# EasyEDA Pro project Project.eprj

# Schematic Main
Create Date: 2022-11-24; Page Name: P1; Project Name: OpenWDMX-Ext; Schematic Name: Main; Update Date: 2022-11-25; Company: EasyEDA.com; Drawed: EasyEDA Pro; Page Size: A4; Part Number: JLCPCB-002; Reviewed: EasyEDA Pro; Version: V0.1
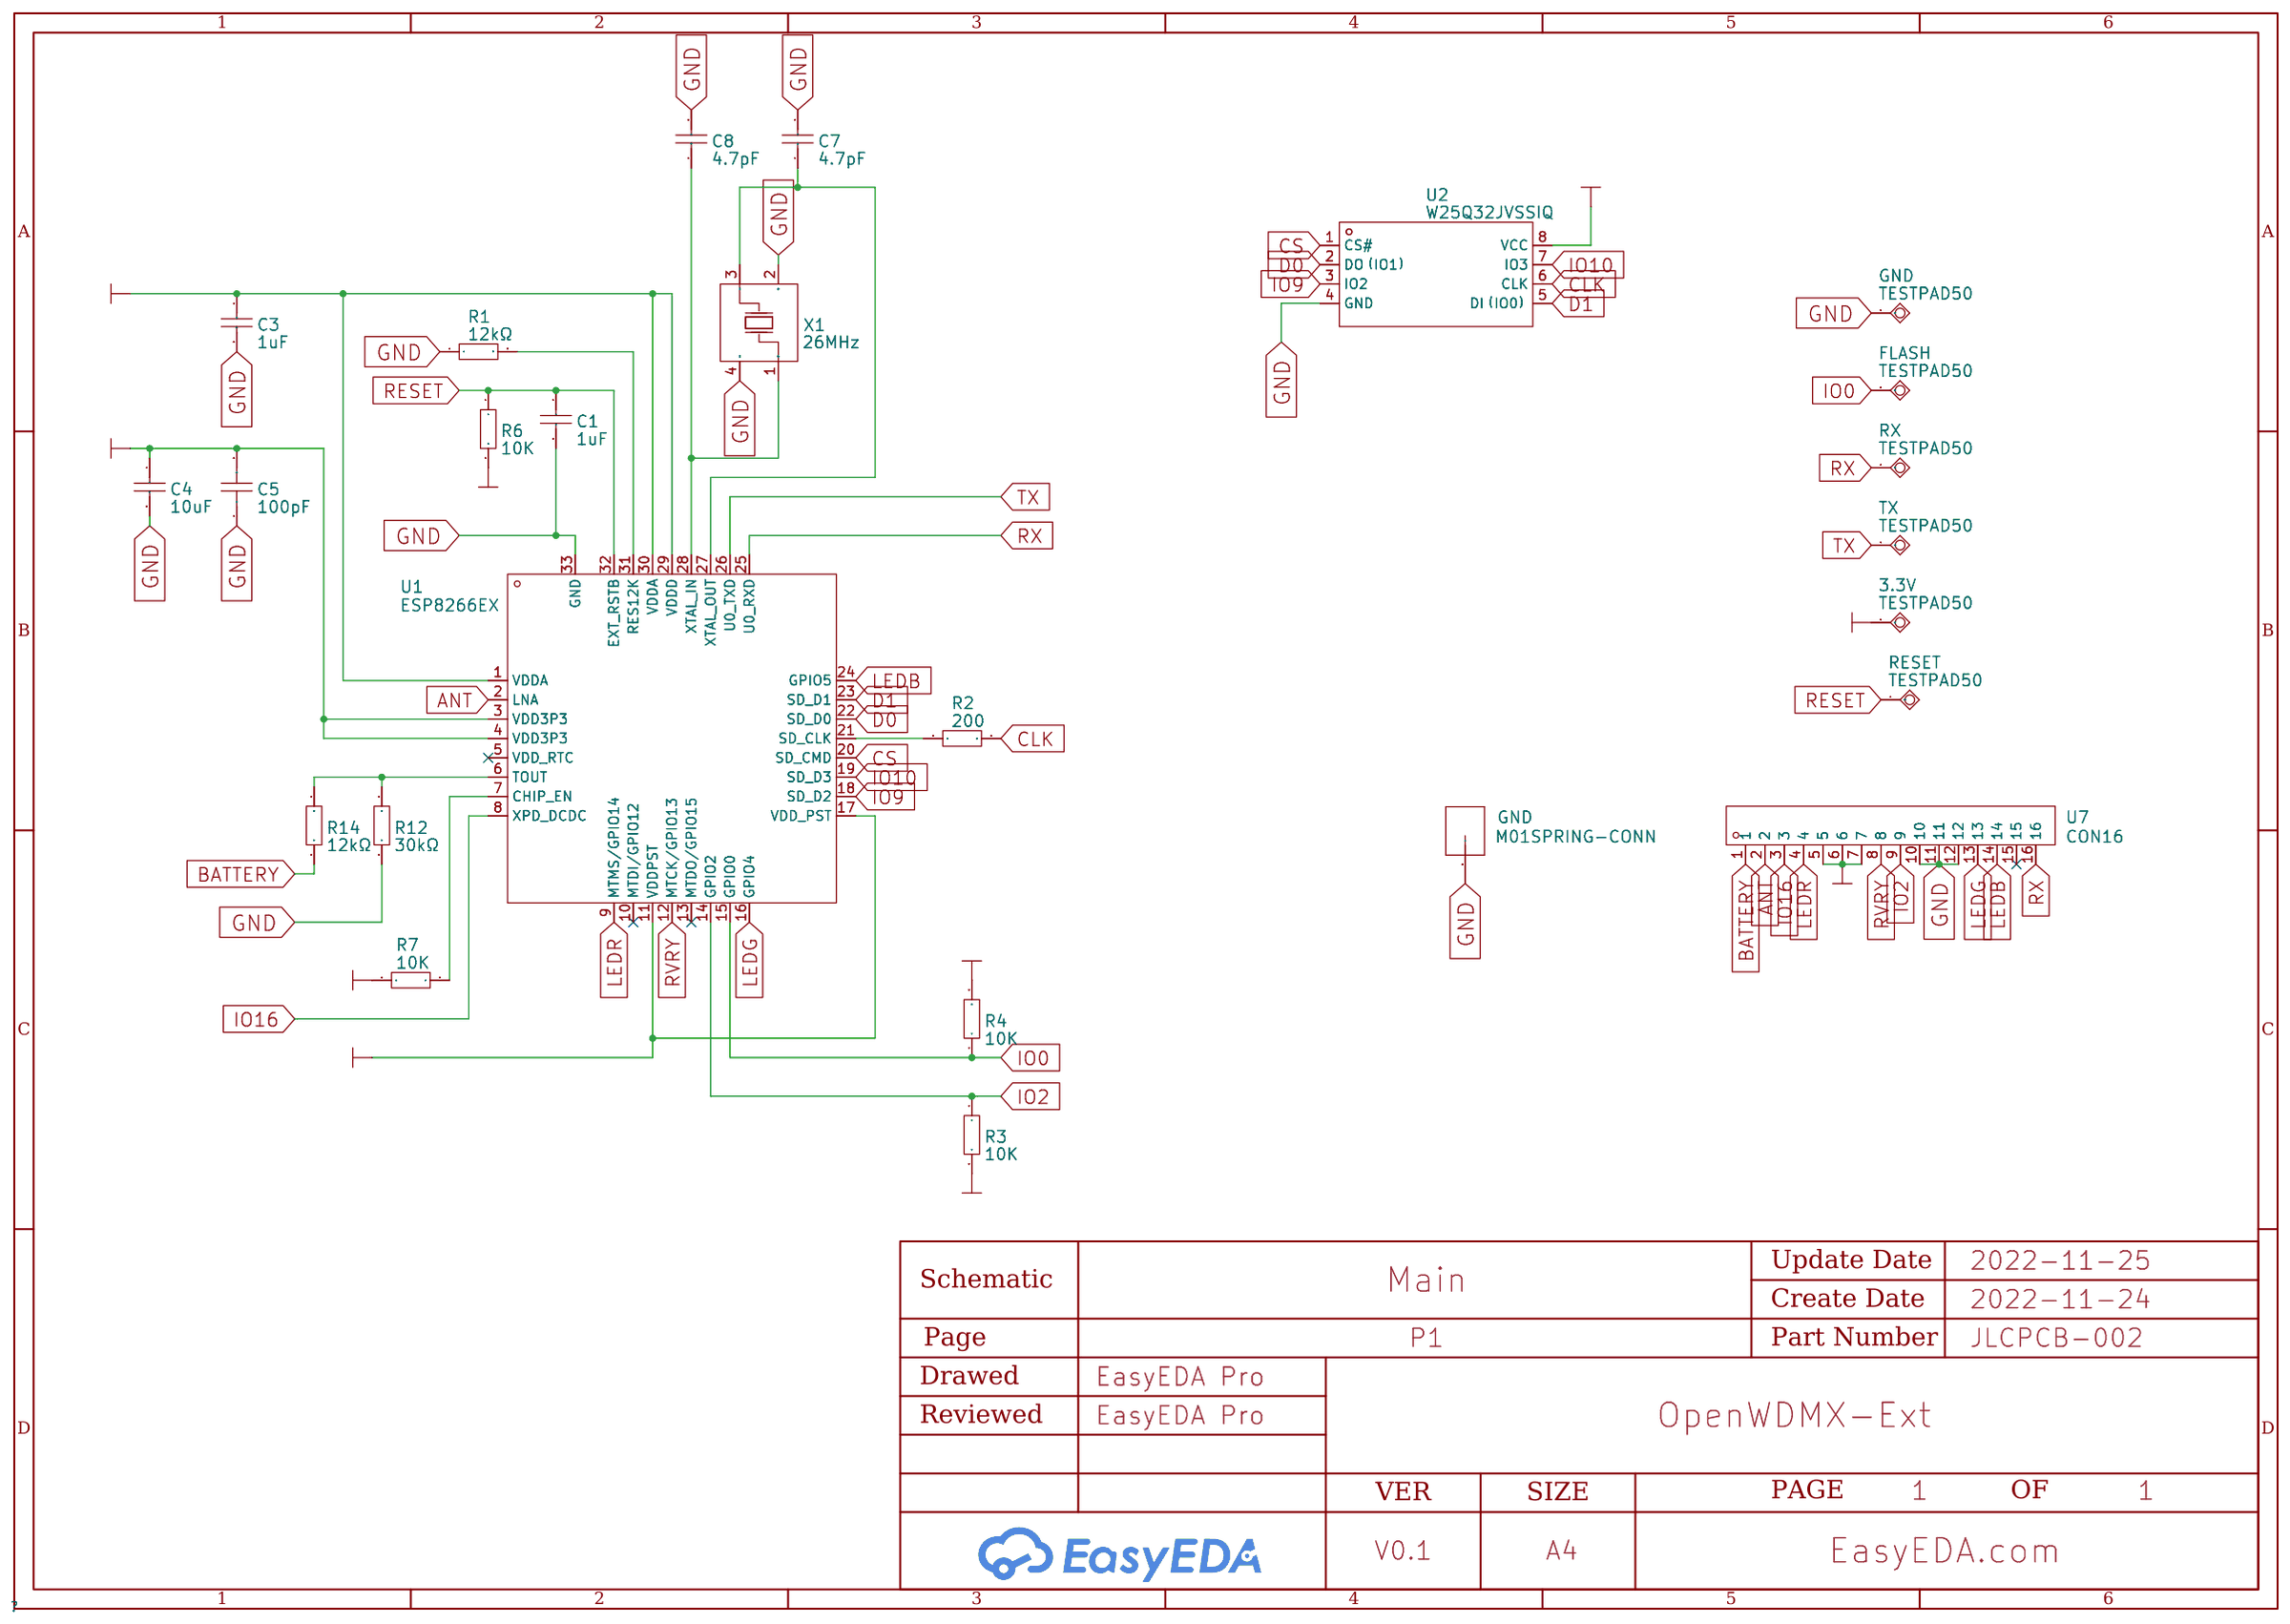
[diagram p0: schematic sheet]

## Parts
3.3V  TESTPAD50  [TESTPAD-50-ROUND]
C1  1uF  [C0402]
C3  1uF  [C0402]
C4  10uF  [C0402]
C5  100pF  [C0603]
C7  4.7pF  [C0402]
C8  4.7pF  [C0402]
FLASH  TESTPAD50  [TESTPAD-50-ROUND]
GND  M01SPRING-CONN  [SPRING-CONNECTOR]
GND#2  TESTPAD50  [TESTPAD-50-ROUND]
R1  12kΩ  [R0402]
R2  200  [R0402]
R3  10K  [R0402]
R4  10K  [R0402]
R6  10K  [R0402]
R7  10K  [R0402]
R12  30kΩ  [R0402]
R14  12kΩ  [R0402]
RESET  TESTPAD50  [TESTPAD-50-ROUND]
RX  TESTPAD50  [TESTPAD-50-ROUND]
TX  TESTPAD50  [TESTPAD-50-ROUND]
U1  ESP8266EX  [QFN-32_L5.0-W5.0-P0.50-BL-EP3.7]
U2  W25Q32JVSSIQ  [SOIC-8_L5.3-W5.3-P1.27-LS8.0-BL]
U7  CON16  [CON16]
X1  26MHz  [CRYSTAL-SMD_4P-L3.2-W2.5-BL]

## Library data of the parts
3.3V FLASH GND#2 RESET RX TX = TESTPAD50
C1 C3 = 1uF: link: https://item.szlcsc.com/15869.html; 3DModel: C0402_L1.0-W0.5-H0.5; Supplier: LCSC; Manufacturer Part: CL05A105KP5NNNC; Manufacturer: SAMSUNG; Supplier Part: C14445; JLCPCB Part Class: Extended Part
C4 = 10uF: link: https://item.szlcsc.com/15869.html; 3DModel: C0402_L1.0-W0.5-H0.5; Supplier: LCSC; Manufacturer Part: CL05A106MQ5NUNC; Manufacturer: SAMSUNG; Supplier Part: C15525; JLCPCB Part Class: Basic Part
C5 = 100pF: link: https://item.szlcsc.com/362304.html; 3DModel: C0603_L1.6-W0.8-H0.8; Supplier: LCSC; Manufacturer: YAGEO(国巨); Manufacturer Part: CC0603JRNPO9BN101; Supplier Part: C14665; JLCPCB Part Class: Extended Part
C7 C8 = 4.7pF: link: https://item.szlcsc.com/15869.html; 3DModel: C0402_L1.0-W0.5-H0.5; Supplier: LCSC; Manufacturer: FH; Manufacturer Part: 0402CG4R7C500NT; Supplier Part: C1569; JLCPCB Part Class: Basic Part
GND = M01SPRING-CONN
R1 R14 = 12kΩ: link: https://item.szlcsc.com/323315.html; 3DModel: R0402_L1.0-W0.5-H0.5; Supplier: LCSC; Manufacturer: RALEC; Manufacturer Part: RTT021202FTH; Supplier Part: C102781; Resistance: 12K; JLCPCB Part Class: Extended Part
R2 = 200: link: https://item.szlcsc.com/323315.html; 3DModel: R0402_L1.0-W0.5-H0.5; Supplier: LCSC; Manufacturer: YAGEO(国巨); Manufacturer Part: RC0402FR-07200RL; Supplier Part: C114764; JLCPCB Part Class: Extended Part; Resistance: 200Ω
R3 R4 R6 R7 = 10K: link: https://item.szlcsc.com/323315.html; 3DModel: R0402_L1.0-W0.5-H0.5; Supplier: LCSC; Manufacturer: YAGEO; Manufacturer Part: RC0402FR-0710KL; Supplier Part: C60490; JLCPCB Part Class: Extended Part; Resistance: 10kΩ
R12 = 30kΩ: link: https://item.szlcsc.com/323315.html; 3DModel: R0402_L1.0-W0.5-H0.5; Supplier: LCSC; Supplier Part: C317882; Manufacturer: Guangdong Fenghua Advanced Tech; Manufacturer Part: RC-02W3002FT; Resistance: 30K; JLCPCB Part Class: Extended Part
U1 = ESP8266EX: link: https://item.szlcsc.com/18002.html; 3DModel: QFN-32_L5.0-W5.0-H0.8-P0.50-BL-EP3.7; Supplier: LCSC; Manufacturer: ESPRESSIF; Supplier Part: C77967; JLCPCB Part Class: Extended Part; Frequency: 2.4GHz
U2 = W25Q32JVSSIQ: link: https://item.szlcsc.com/63461.html; 3DModel: SOIC-8_L5.3-W5.3-H1.9-LS7.9-P1.27; Supplier: LCSC; Manufacturer: WINBOND; Supplier Part: C82344; JLCPCB Part Class: Extended Part
U7 = CON16
X1 = 26MHz: link: https://item.szlcsc.com/15866.html; 3DModel: OSC-SMD_4P-L3.2-W2.5-H1.0; Supplier: LCSC; Manufacturer: YXC; Manufacturer Part: X322526MMB4SI; Supplier Part: C15192; JLCPCB Part Class: Extended Part

## Nets
+3.3V: 3.3V.1(PP) C3.1 C4.1 C5.2 R3.2 R4.2 R6.2 R7.2 U1.1(VDDA) U1.3(VDD3P3) U1.4(VDD3P3) U1.11(VDDPST) U1.17(VDD_PST) U1.29(VDDD) U1.30(VDDA) U2.8(VCC) U7.5 U7.6 U7.7
GND: C1.2 C3.2 C4.2 C5.1 C7.2 C8.2 GND.P$2(1) GND#2.1(PP) R1.1 R12.2 U1.33(GND) U2.4(GND) U7.10 U7.11 U7.12 X1.2(GND) X1.4(GND)
ANT: U1.2(LNA) U7.2
BATTERY: R14.2 U7.1
CLK: R2.2 U2.6(CLK)
CS: U1.20(SD_CMD) U2.1(CS#)
D0: U1.22(SD_D0) U2.2(DO（IO1）)
D1: U1.23(SD_D1) U2.5(DI（IO0）)
IO0: FLASH.1(PP) R4.1 U1.15(GPIO0)
IO2: R3.1 U1.14(GPIO2) U7.9
IO9: U1.18(SD_D2) U2.3(IO2)
IO10: U1.19(SD_D3) U2.7(IO3)
IO16: U1.8(XPD_DCDC) U7.3
LEDB: U1.24(GPIO5) U7.14
LEDG: U1.16(GPIO4) U7.13
LEDR: U1.9(MTMS/GPIO14) U7.4
RESET: C1.1 R6.1 RESET.1(PP) U1.32(EXT_RSTB)
RVRY: U1.12(MTCK/GPIO13) U7.8
RX: RX.1(PP) U1.25(U0_RXD) U7.16
TX: TX.1(PP) U1.26(U0_TXD)
$1N18697: R1.2 U1.31(RES12K)
$1N18698: R7.1 U1.7(CHIP_EN)
$1N18707: C8.1 U1.28(XTAL_IN) X1.1(OSC1)
$1N18708: C7.1 U1.27(XTAL_OUT) X1.3(OSC2)
$1N18714: R2.1 U1.21(SD_CLK)
$1N18731: R12.1 R14.1 U1.6(TOUT)

Not connected (* = marked no-connect by the designer): U1 5(VDD_RTC)* 10(MTDI/GPIO12)* 13(MTDO/GPIO15)*; U7 15*

# Schematic Output
Create Date: 2022-11-25; Page Name: P1; Project Name: OpenWDMX-Ext; Schematic Name: Output; Update Date: 2022-11-25; Company: EasyEDA.com; Drawed: EasyEDA Pro; Page Size: A4; Part Number: JLCPCB-002; Reviewed: EasyEDA Pro; Version: V0.1
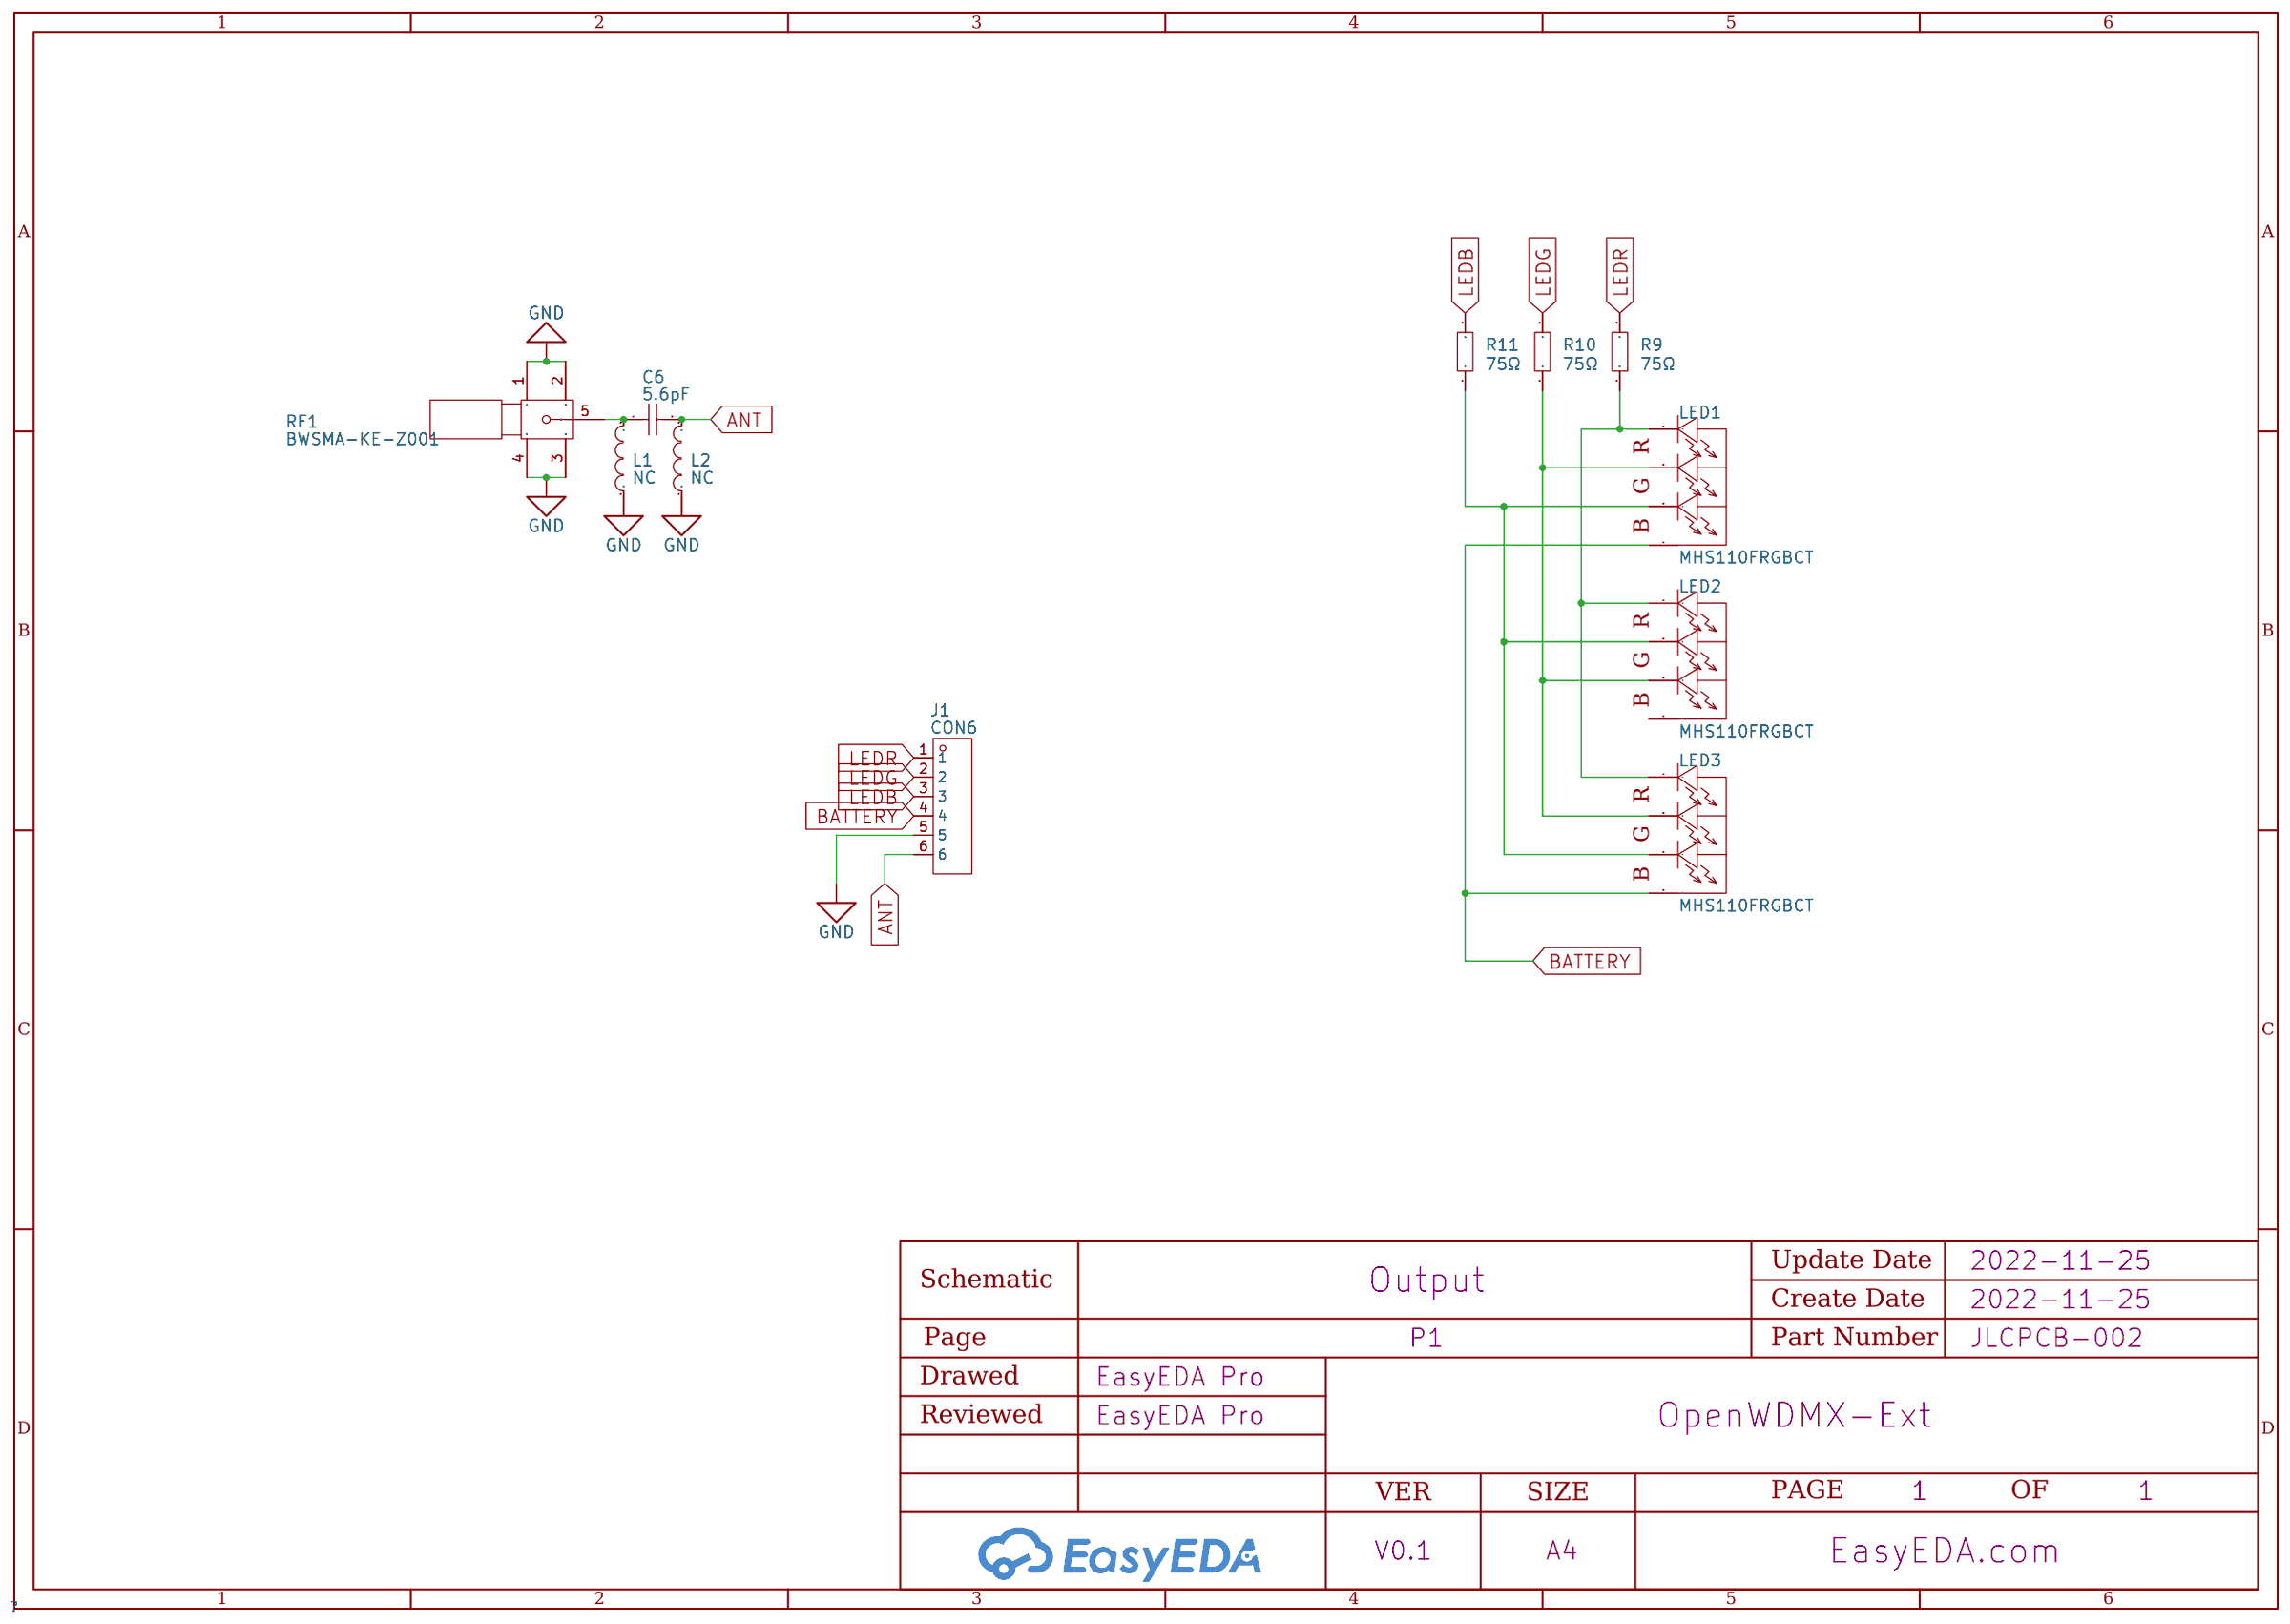
[diagram p1: schematic sheet]

## Parts
C6  5.6pF  [C0603]
J1  CON6  [CON6]
L1  NC  [L0402]
L2  NC  [L0402]
LED1  MHS110FRGBCT  [LED-ARRAY-SMD_MHS110FRGBCT]
LED2  MHS110FRGBCT  [LED-ARRAY-SMD_MHS110FRGBCT]
LED3  MHS110FRGBCT  [LED-ARRAY-SMD_MHS110FRGBCT]
R9  75Ω  [R0603]
R10  75Ω  [R0603]
R11  75Ω  [R0603]
RF1  BWSMA-KE-Z001  [SMA-TH_BWSMA-KE-Z001]

## Library data of the parts
C6 = 5.6pF: link: https://item.szlcsc.com/362304.html; 3DModel: C0603_L1.6-W0.8-H0.8; Supplier: LCSC; Manufacturer: FH(风华); Manufacturer Part: 0603CG5R6C500NT; Supplier Part: C1674; JLCPCB Part Class: Extended Part
J1 = CON6
L1 L2 = NC: link: https://item.szlcsc.com/344049.html; 3DModel: L0402_L1.0-W0.5-H0.5_BEAD; Supplier: LCSC; Manufacturer: Sunlord; Manufacturer Part: SDCL1005C1N5STDF; Supplier Part: C27146; JLCPCB Part Class: Extended Part
LED1-LED3 = MHS110FRGBCT: link: https://item.szlcsc.com/508375.html; Supplier: LCSC; Supplier Part: C496820; Manufacturer: MEIHUA(美华); JLCPCB Part Class: Extended Part
R9-R11 = 75Ω: 3DModel: R0603_L1.6-W0.8-H0.8; link: https://www.mouser.in/datasheet/2/447/PYu_RT_1_to_0_01_RoHS_L_11-1669912.pdf; Supplier: LCSC; Manufacturer: UNI-ROYAL(厚声); Manufacturer Part: 0603WAF750JT5E; Supplier Part: C4275; Resistance: 75; JLCPCB Part Class: Basic Part
RF1 = BWSMA-KE-Z001: link: https://item.szlcsc.com/508498.html; 3DModel: SMA-TH_5P-L6.5-W6.5-H9.8_BWSMA-KE-Z001; Supplier: LCSC; Supplier Part: C496549; Manufacturer: BAT WIRELESS; JLCPCB Part Class: Extended Part

## Nets
GND: J1.5 L1.1 L2.1 RF1.1 RF1.2 RF1.3 RF1.4
ANT: C6.2 J1.6 L2.2
BATTERY: J1.4 LED1.1(+) LED3.1(+)
LEDB: J1.3 R11.2
LEDG: J1.2 R10.1
LEDR: J1.1 R9.2
$1N395: C6.1 L1.2 RF1.5
$1N1788: LED1.4(-) LED2.4(-) LED3.4(-) R9.1
Net-(LED1-2): LED1.2(-) LED2.3(-) LED3.2(-) R11.1
Net-(LED1-3): LED1.3(-) LED2.2(-) LED3.3(-) R10.2

Not connected (* = marked no-connect by the designer): LED2 1(+)

# Schematic Selector
Create Date: 2022-11-25; Page Name: P1; Project Name: OpenWDMX-Ext; Schematic Name: Selector; Update Date: 2022-11-25; Company: EasyEDA.com; Drawed: EasyEDA Pro; Page Size: A4; Part Number: JLCPCB-002; Reviewed: EasyEDA Pro; Version: V0.1
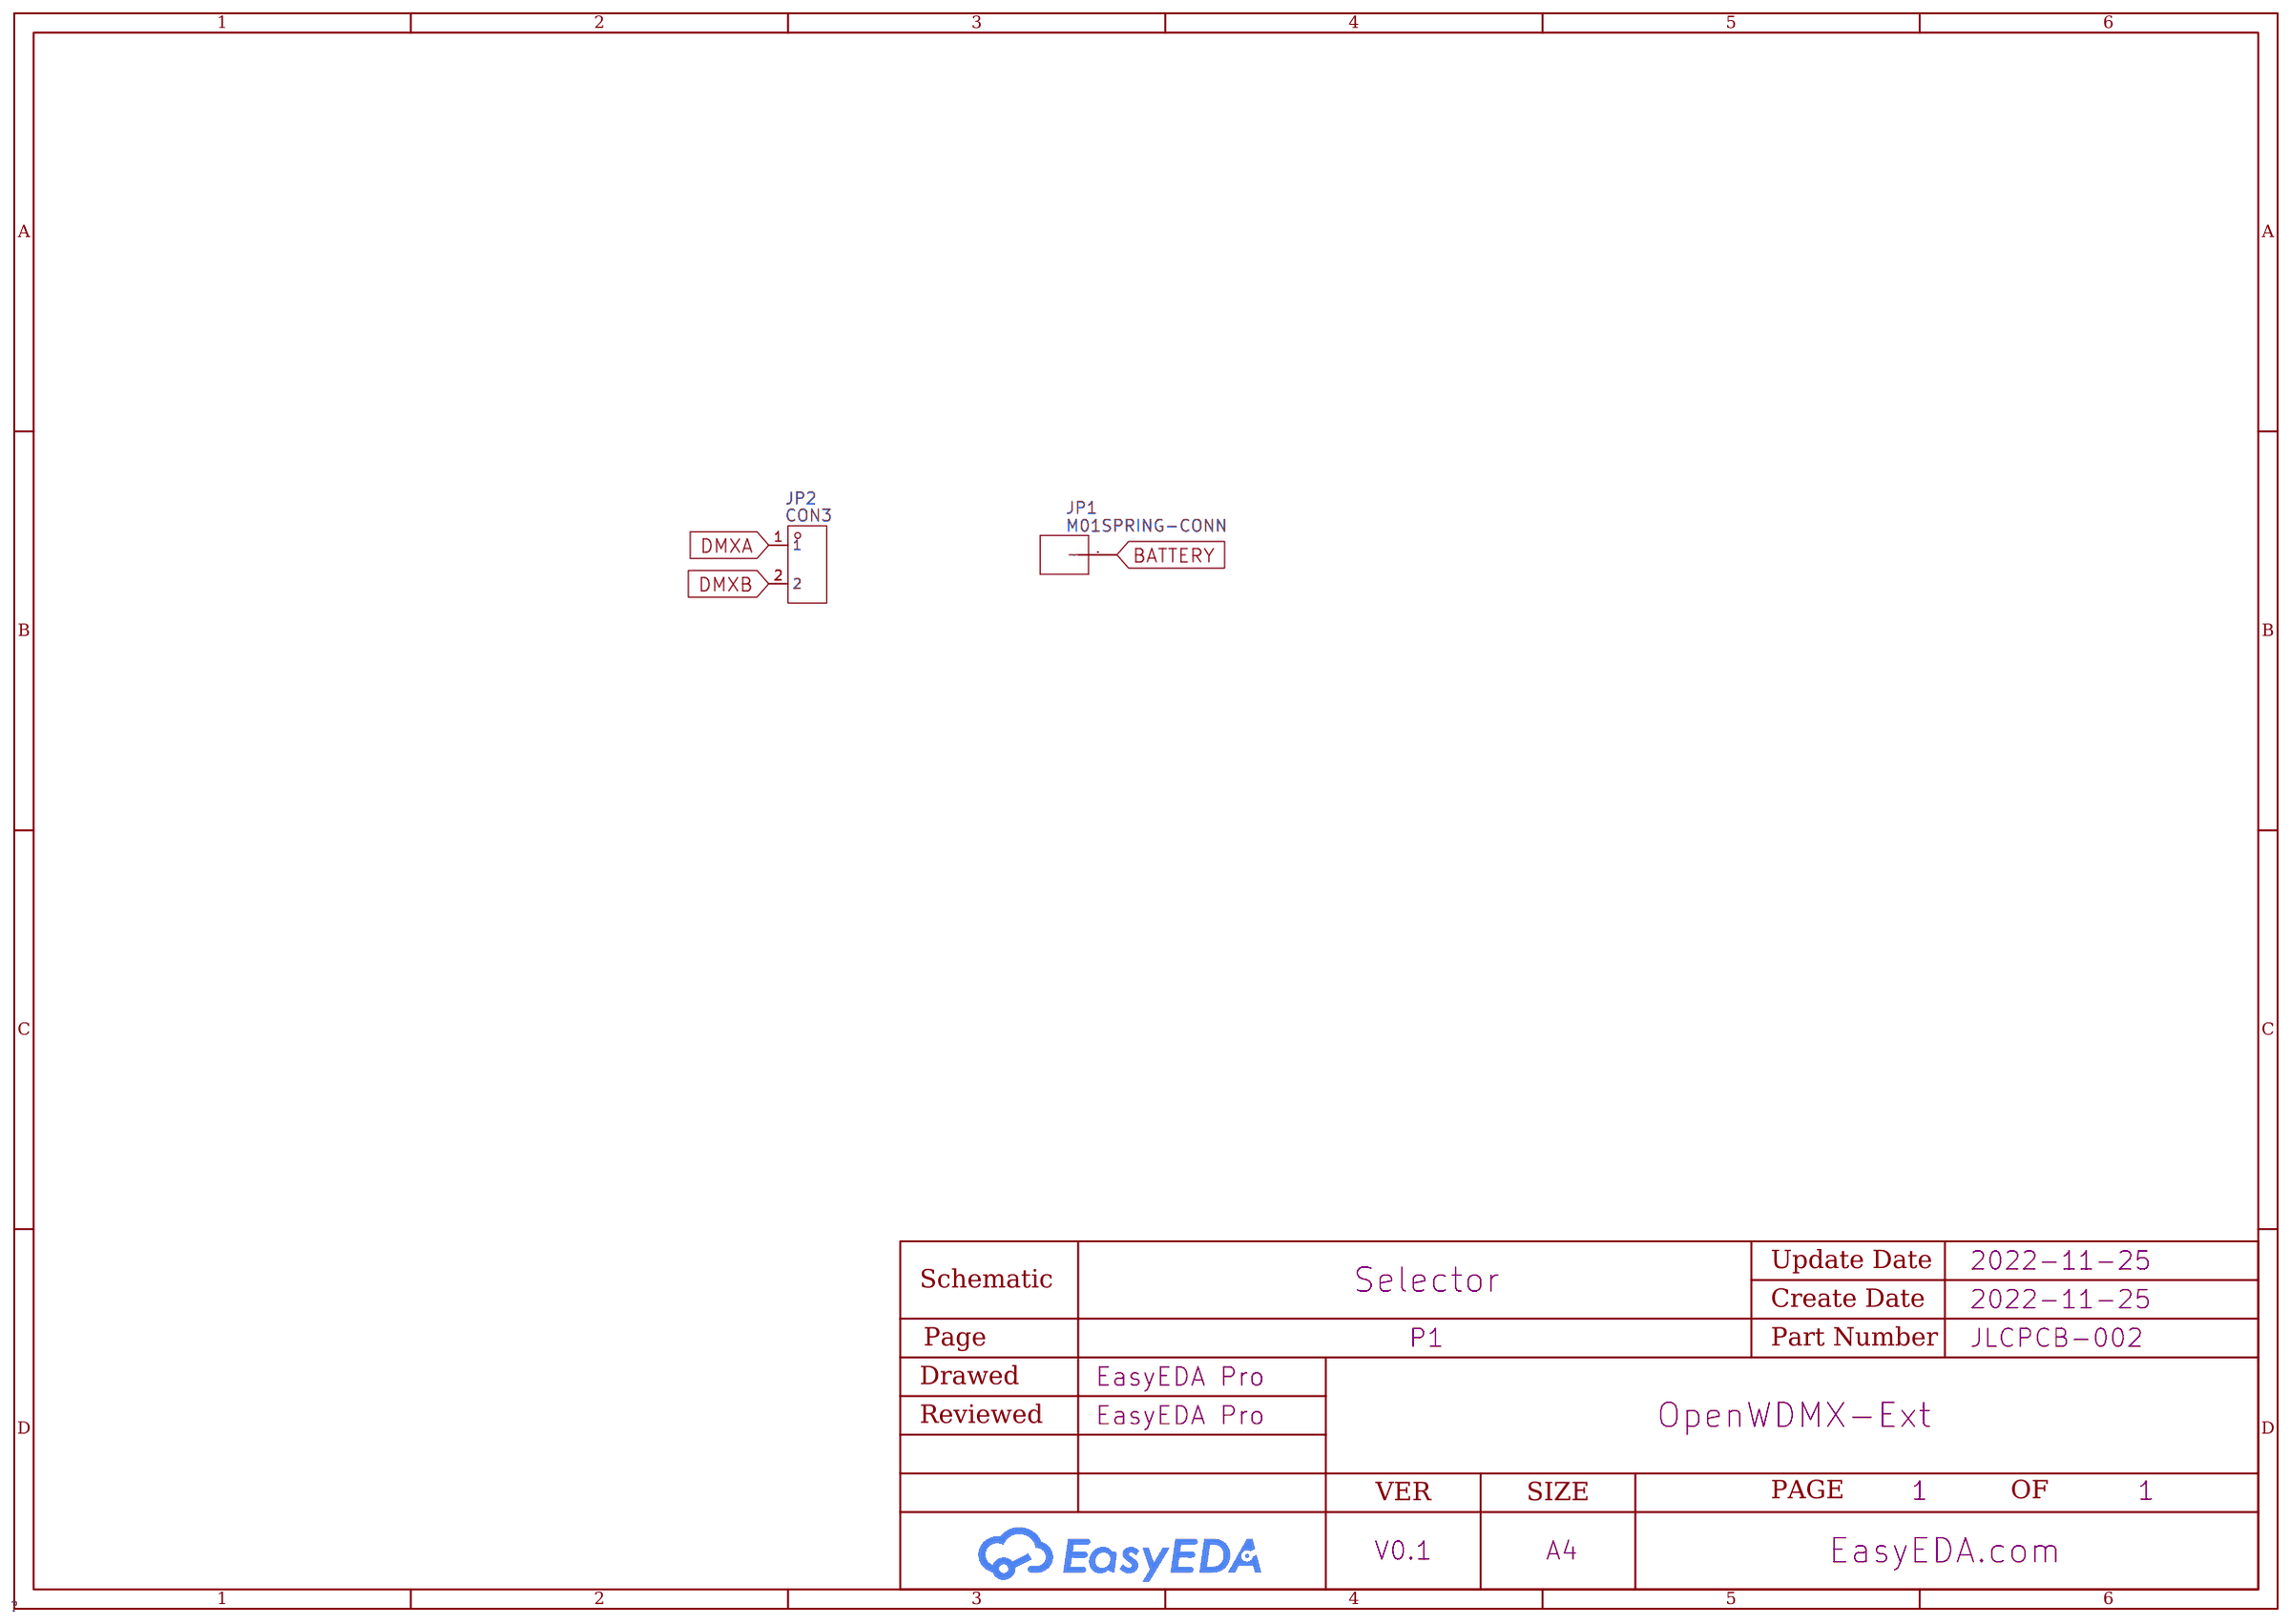
[diagram p2: schematic sheet]

## Parts
JP1  M01SPRING-CONN  [SPRING-CONNECTOR]
JP2  CON3  [CON3]

## Library data of the parts
JP1 = M01SPRING-CONN
JP2 = cON3

## Nets
BATTERY: JP1.P$2(1)
DMXA: JP2.1
DMXB: JP2.2

# Schematic Power
Create Date: 2022-11-25; Page Name: P1; Project Name: OpenWDMX-Ext; Schematic Name: Power; Update Date: 2022-11-25; Company: EasyEDA.com; Drawed: EasyEDA Pro; Page Size: A4; Part Number: JLCPCB-002; Reviewed: EasyEDA Pro; Version: V0.1
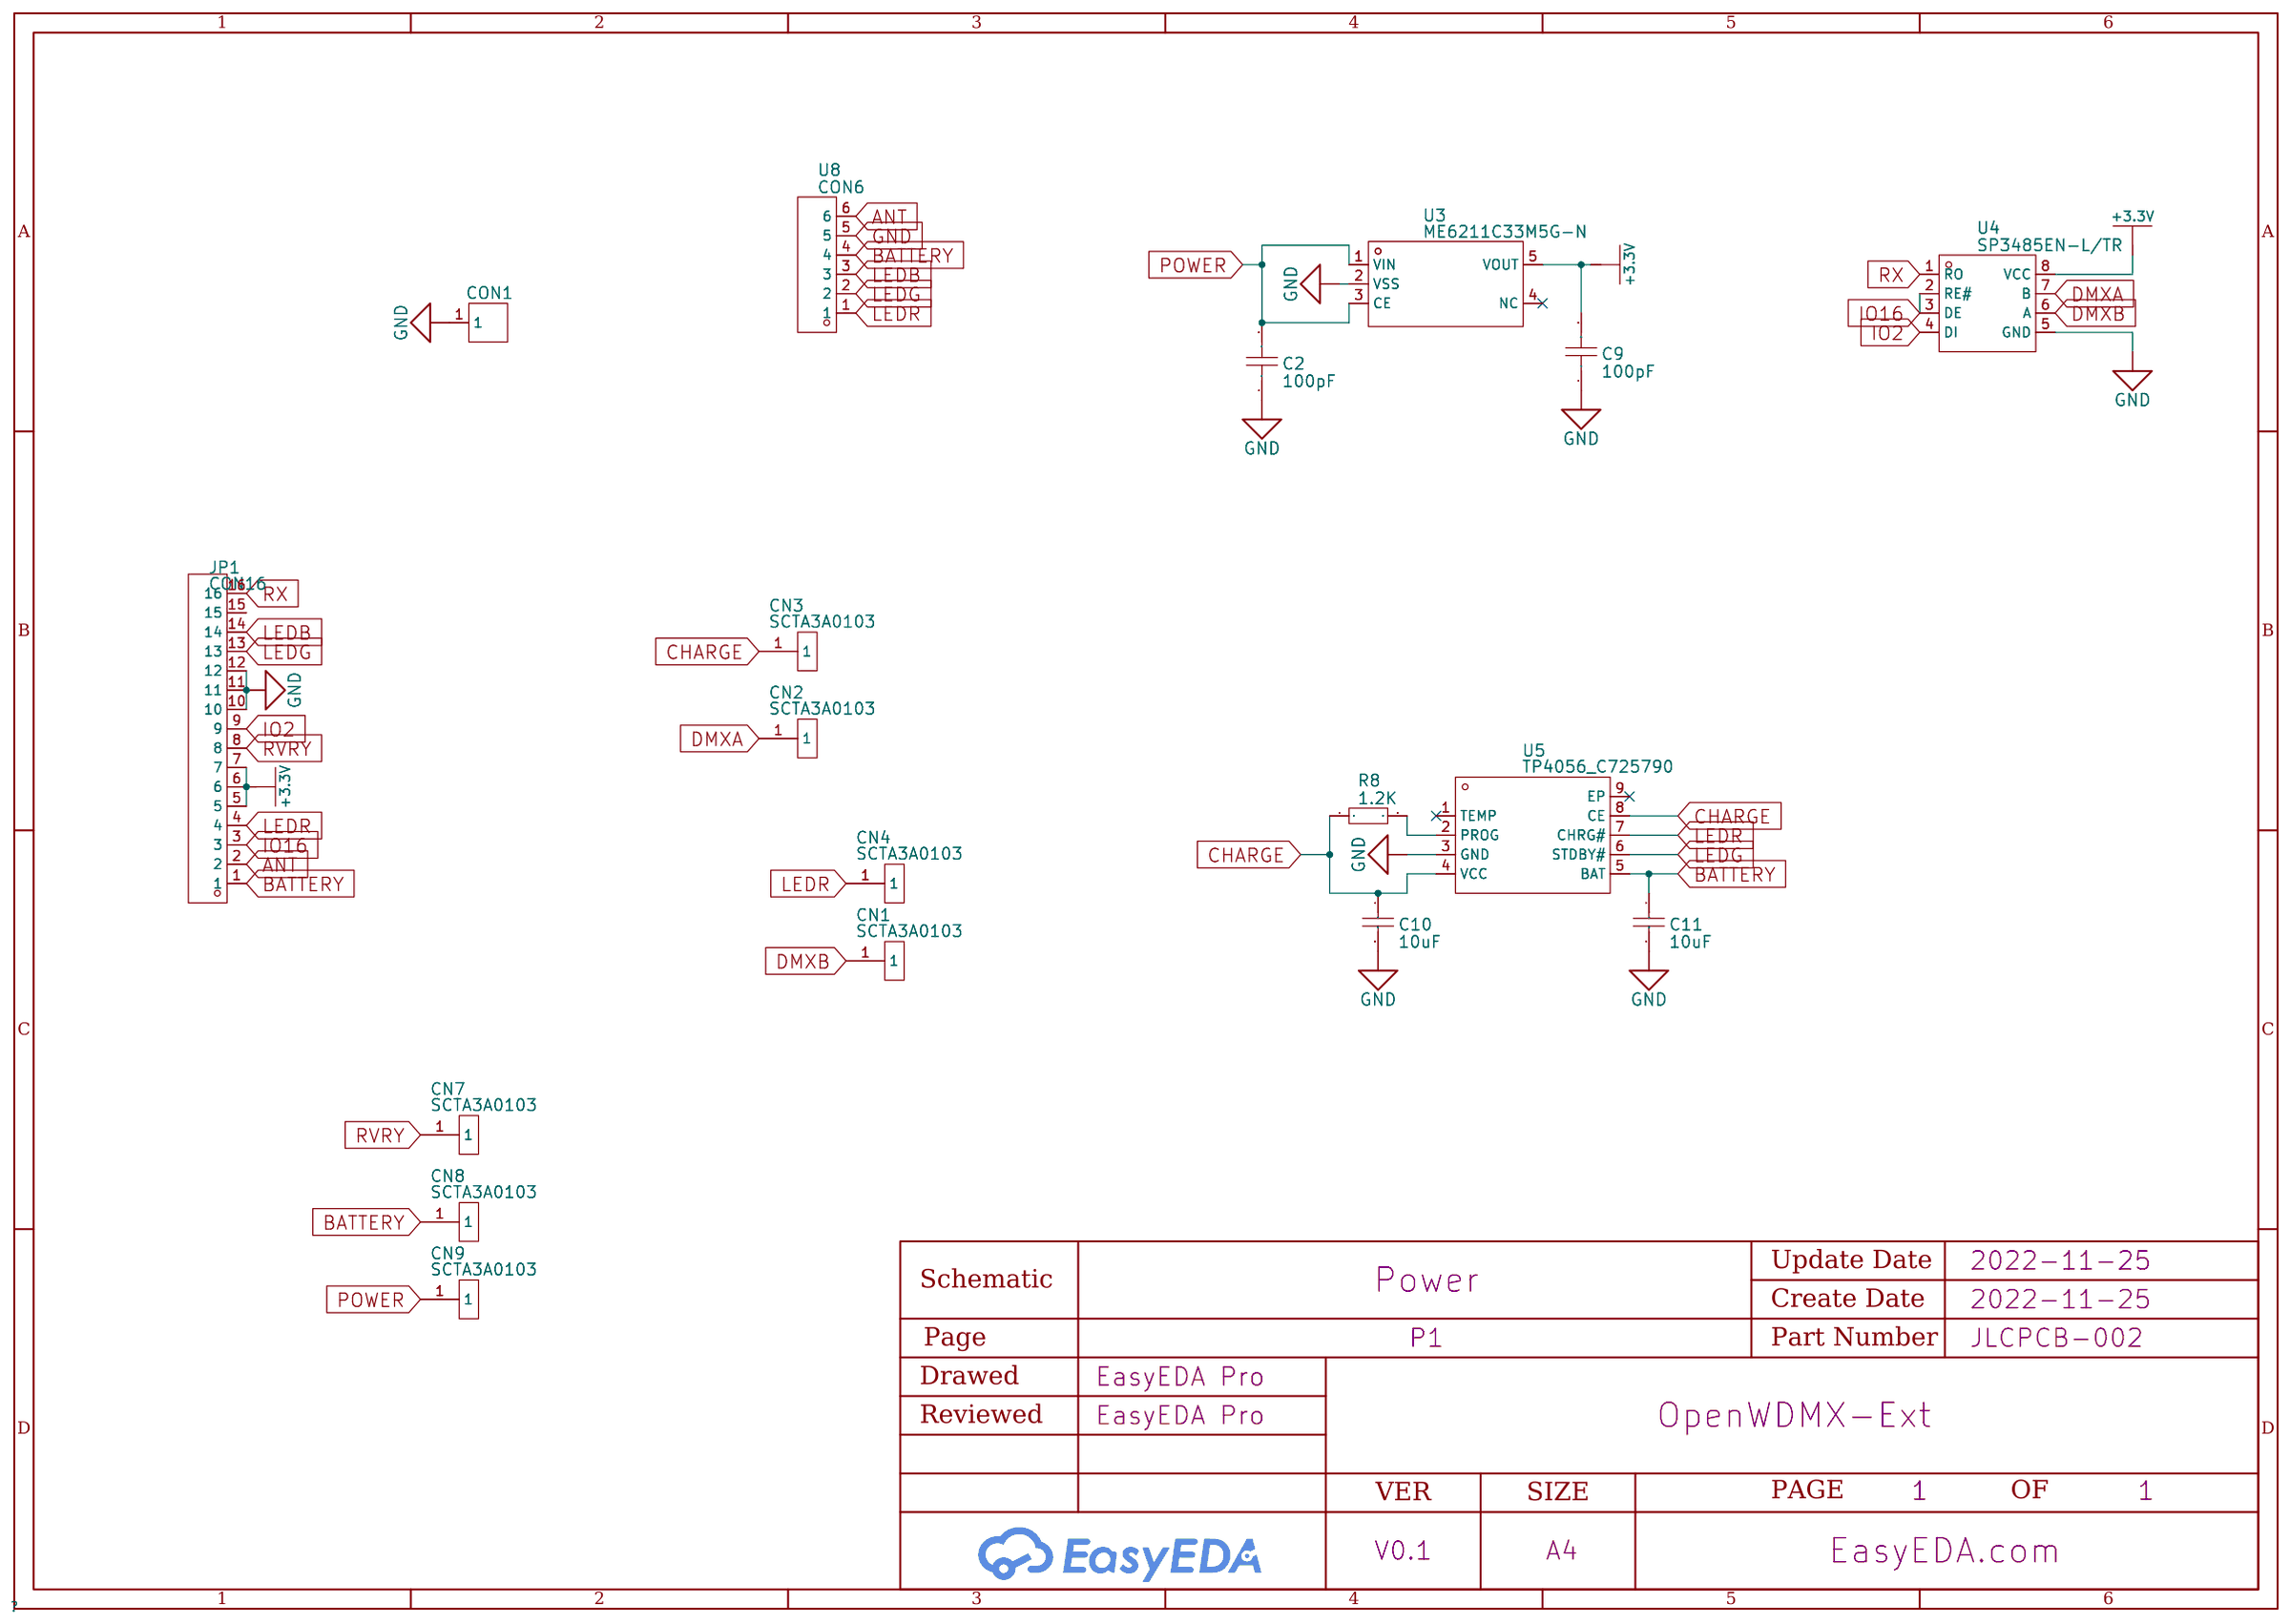
[diagram p3: schematic sheet]

## Parts
C2  100pF  [C0603]
C9  100pF  [C0603]
C10  10uF  [C0402]
C11  10uF  [C0402]
CN1  SCTA3A0103  [SCTA1A0100]
CN2  SCTA3A0103  [SCTA1A0100]
CN3  SCTA3A0103  [SCTA1A0100]
CN4  SCTA3A0103  [SCTA1A0100]
CN7  SCTA3A0103  [SCTA1A0100]
CN8  SCTA3A0103  [SCTA1A0100]
CN9  SCTA3A0103  [SCTA1A0100]
JP1  CON16  [CON16]
R8  1.2K  [R0402]
U3  ME6211C33M5G-N  [SOT-23-5_L3.0-W1.7-P0.95-LS2.8-BR]
U4  SP3485EN-L/TR  [SOIC-8_L5.0-W4.0-P1.27-LS6.0-BL]
U5  TP4056_C725790  [ESOP-8_L4.9-W3.9-P1.27-LS6.0-BL-EP]
U8  CON6  [CON6]
U10  CON1  [CON1]

## Library data of the parts
C2 C9 = 100pF: link: https://item.szlcsc.com/362304.html; 3DModel: C0603_L1.6-W0.8-H0.8; Supplier: LCSC; Manufacturer: YAGEO(国巨); Manufacturer Part: CC0603JRNPO9BN101; Supplier Part: C14665; JLCPCB Part Class: Extended Part
C10 C11 = 10uF: link: https://item.szlcsc.com/15869.html; 3DModel: C0402_L1.0-W0.5-H0.5; Supplier: LCSC; Manufacturer Part: CL05A106MQ5NUNC; Manufacturer: SAMSUNG; Supplier Part: C15525; JLCPCB Part Class: Basic Part
CN1-CN4 CN7-CN9 = SCTA3A0103: link: https://item.szlcsc.com/203584.html; Supplier: LCSC; Supplier Part: C202386; Manufacturer: ALPS Electric; JLCPCB Part Class: Extended Part
JP1 = CON16
R8 = 1.2K: link: https://item.szlcsc.com/323315.html; 3DModel: R0402_L1.0-W0.5-H0.5; Supplier: LCSC; Manufacturer: YAGEO(国巨); Manufacturer Part: RC0402FR-071K2L; Supplier Part: C138040; JLCPCB Part Class: Extended Part; Resistance: 1.2kΩ
U3 = ME6211C33M5G-N: link: https://item.szlcsc.com/236104.html; 3DModel: SOT-23-5_L2.9-W1.6-H1.1-LS2.8-P0.95; Supplier: LCSC; Manufacturer: MICRONE; Supplier Part: C82942; JLCPCB Part Class: Extended Part
U4 = SP3485EN-L/TR: link: https://item.szlcsc.com/417287.html; 3DModel: SOIC-8_L4.9-W3.9-H1.7-LS6.0-P1.27; Supplier: LCSC; Manufacturer: EXAR; Supplier Part: C8963; JLCPCB Part Class: Basic Part
U5 = TP4056_C725790: link: https://www.mornsun.cn/html/pdf/SCM1501B.html; 3DModel: ESOP-8_L4.9-W3.9-H1.6-LS6.0-P1.27; Supplier: LCSC; Supplier Part: C725790; Manufacturer: UMW(友台半导体); Manufacturer Part: TP4056; JLCPCB Part Class: Extended Part
U8 = CON6
U10 = CON1

## Nets
+3.3V: C9.2 JP1.5 JP1.6 JP1.7 U3.5(VOUT) U4.8(VCC)
GND: C2.1 C9.1 C10.2 C11.2 JP1.10 JP1.11 JP1.12 U3.2(VSS) U4.5(GND) U5.3(GND) U8.5 U10.1
ANT: JP1.2 U8.6
BATTERY: C11.1 CN8.1 JP1.1 U5.5(BAT) U8.4
CHARGE: C10.1 CN3.1 R8.1 U5.4(VCC) U5.8(CE)
DMXA: CN2.1 U4.7(B)
DMXB: CN1.1 U4.6(A)
IO2: JP1.9 U4.4(DI)
IO16: JP1.3 U4.2(RE#) U4.3(DE)
LEDB: JP1.14 U8.3
LEDG: JP1.13 U5.6(STDBY#) U8.2
LEDR: CN4.1 JP1.4 U5.7(CHRG#) U8.1
POWER: C2.2 CN9.1 U3.1(VIN) U3.3(CE)
RVRY: CN7.1 JP1.8
RX: JP1.16 U4.1(RO)
$1N2499: R8.2 U5.2(PROG)

Not connected (* = marked no-connect by the designer): JP1 15; U3 4(NC)*; U5 1(TEMP)* 9(EP)*

# Board PCB-Output
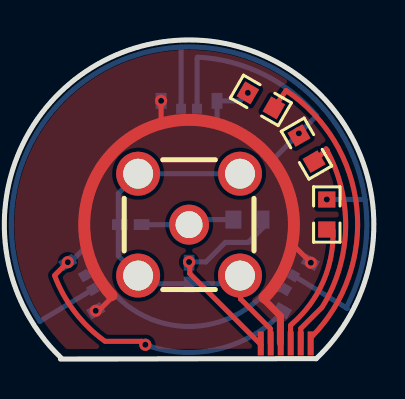
[diagram p4: board, top side]
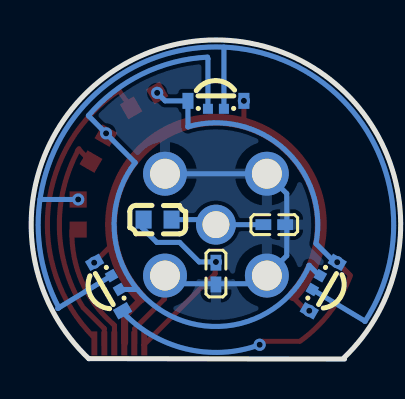
[diagram p5: board, bottom side, seen from below]

Outline 18.5 x 15.98 mm; copper layers: Top Layer, Bottom Layer. Coordinates in mm from the lower left corner of the outline.
Outline path: 2.81,0 15.62,0.02 arc(9.27,15.98) 2.85,0.05
Stack: Top Layer 0.035mm / Dielectric1 1.51mm FR4 er 4.5 / Bottom Layer 0.035mm

## Design rules (mm)
spacing Default (default): track to track 0.152, other pairs 0 to 0.152
track width Default (default): min 0.254, default 0.254, max 25.4
differential pair differentialPair (default): width min 0.127, default 0.254, max 2.54; gap min 0.152, default 0.152
via Default (default): diameter min 0.61, default 0.61, max 100.025; hole min 0.305, default 0.305, max 59.995

## Placement (name value [footprint] x y rotation side)
C6  5.6pF  [C0603]  12.17 6.98 0 bottom
J1  -  [CON6]  14.09 0.78 180 top
L1  NC  [L0402]  6.33 6.73 0 bottom
L2  NC  [L0402]  9.25 4.28 90 bottom
LED1  MHS110FRGBCT  [LED-ARRAY-SMD_MHS110FRGBCT]  9.25 12.73 180 bottom
LED2  MHS110FRGBCT  [LED-ARRAY-SMD_MHS110FRGBCT]  14.45 3.73 60 bottom
LED3  MHS110FRGBCT  [LED-ARRAY-SMD_MHS110FRGBCT]  4.05 3.73 300 bottom
R9  75Ω  [R0603]  12.84 12.95 330 top
R10  75Ω  [R0603]  15.13 10.54 120 top
R11  75Ω  [R0603]  16.14 7.24 270 top
RF1  BWSMA-KE-Z001  [SMA-TH_BWSMA-KE-Z001]  9.25 6.73 0 top

## Footprints (pads in the part's own frame, mm; a bottom-side part is the same pattern mirrored in y, then rotated)
C0603
  rect 0.8x0.9 smd: 1(-0.7,0) 2(0.7,0)
CON6
  rect 0.3x1.2 smd: 1(-1.246,0) 2(-0.746,0) 3(-0.246,0) 4(0.254,0) 5(0.754,0) 6(1.254,0)
L0402
  rect 0.79x0.54 smd: 1(-0.545,0) 2(0.545,0)
LED-ARRAY-SMD_MHS110FRGBCT
  rect 0.55x0.8 smd: 1(1.4,0.2) 4(-1.4,0.2)
  rect 0.5x0.5 smd: 2(0.4,-0.2) 3(-0.4,-0.2)
R0603
  rect 0.806x0.864 smd: 1(-0.753,0) 2(0.753,0)
SMA-TH_BWSMA-KE-Z001
  round 2.2 hole 1.5: 1(-2.55,-2.55) 2(-2.55,2.55) 3(2.55,2.55) 4(2.55,-2.55)
  round 2 hole 1.35: 5(-0.001,0)

## Nets
GND: J1.5 L1.1 L2.1 RF1.1 RF1.2 RF1.3 RF1.4
ANT: C6.2 J1.6 L2.2
BATTERY: J1.4 LED1.1 LED2.1 LED3.1
LEDB: J1.3 R11.2
LEDG: J1.2 R10.1
LEDR: J1.1 R9.2
$1N395: C6.1 L1.2 RF1.5
$1N1788: LED1.4 LED2.4 LED3.4 R9.1
$1N1825: LED1.3 LED2.3 LED3.3 R10.2
$1N1873: LED1.2 LED2.2 LED3.2 R11.1

## Via types
v1: diameter 0.61, hole 0.305, Top Layer to Bottom Layer, 9 vias

## Routing (per net, layer and track width the routed paths; a pad name or vN(x,y) marks a point on that pad's centre or on a via; arc(x,y) is an arc through that point)
GND: length 20.5
  Top Layer w0.254: RF1.4 11.83,4.15 11.83,3.01 13.31,1.52 13.31,0.81
  Bottom Layer w0.254: RF1.3 RF1.2 5.7,8.29 5.7,5.18 7.11,3.77 11.39,3.77 RF1.4
ANT: length 10.4
  Top Layer w0.254: 12.86,0.71 9.29,4.28 9.29,4.86
  Bottom Layer w0.254: 12.95,6.98 12.95,6.58 12.21,5.84 11.06,5.84 10.09,4.86 9.29,4.86
  vias: v1(9.25,4.86)
BATTERY: length 31.1
  Top Layer w0.254: v1(4.58,2.42) 4.72,2.42 5.54,3.24 ; 14.28,5.89 14.28,5.89 v1(15.34,4.83) ; v1(7.85,12.93) 7.85,11.64
  Top Layer w0.35: 12.93,3.05 13.82,2.16 13.82,0.8
  Top Layer w0.6: 5.37,3.2 arc(9.33,11.98) 13.03,3.08
LEDB: length 6.4
  Top Layer w0.254: 16.46,6.46 arc(15.96,3.87) 14.4,1.76 14.33,1.68 14.33,0.73
LEDG: length 11.5
  Top Layer w0.254: 16.11,10.53 arc(17.09,6.53) 15.9,2.58 ; 14.84,0.74 14.84,1.52 15.85,2.54 ; R10.1 16.05,10.44 16.18,10.44
LEDR: length 15.2
  Top Layer w0.254: 15.4,1.13 arc(17.65,7.59) 14.1,13.45 R9.2
$1N395: length 4.9
  Bottom Layer w0.254: 11.55,6.98 9.5,6.98 RF1.5 6.79,6.73
$1N1788: length 29.6
  Top Layer w0.254: 5.02,0.91 arc(3.54,2.35) 2.53,4.15 ; 2.52,4.19 v1(3.18,4.85) ; 5.06,0.89 6.89,0.89 v1(7.06,0.72)
  Bottom Layer w0.254: 10.65,11.63 arc(5.81,10.5) 4.24,5.78 3.3,4.84 3.18,4.84 ; 14.01,2.45 arc(10.8,0.52) v1(7.06,0.72) ; v1(12.19,13.33) 11.79,12.93 LED1.4 10.65,11.62
$1N1825: length 31.7
  Bottom Layer w0.254: 9.67,15.12 arc(12.95,14.27) 15.63,12.19 ; 13.3,9.83 arc(11.84,2.34) 4.58,4.69 ; 9.67,15.11 9.65,15.04 LED1.3 ; 14.08,3.48 13.18,3.48 ; 4.59,4.7 4.07,4.18 LED3.3 ; 15.64,12.19 13.3,9.83
  vias: v1(14.75,11.3)
$1N1873: length 48.7
  Bottom Layer w0.254: LED1.2 8.85,15.62 ; v1(16.15,7.99) 18.06,7.99 ; LED3.2 1.8,1.91 1.78,1.89 arc(8.86,15.62) 17.11,2.56 17.16,2.54 14.48,4.18

## Copper pours and planes (outline as drawn; the poured copper is in the pictures)
GND on Bottom Layer: -0.91,17.14 19.28,17.14 19.28,-1.65 -0.91,-1.65
BATTERY on Top Layer: -1.29,17.02 19.54,17.02 19.54,-1.14 -1.29,-1.14

# Board PCB-Main
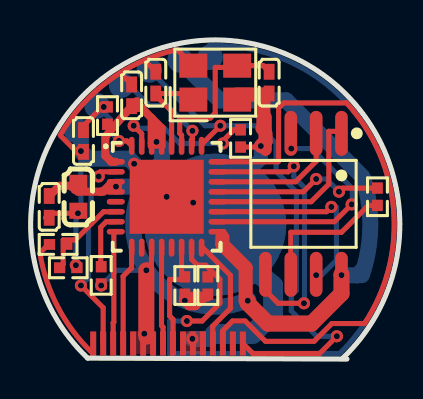
[diagram p6: board, top side]
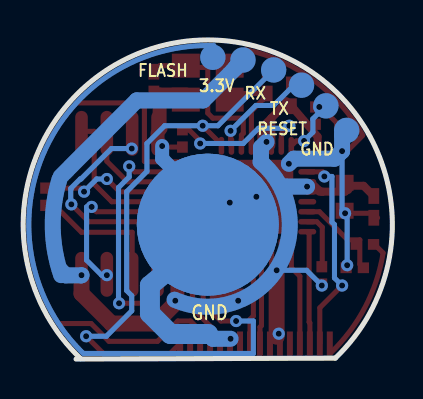
[diagram p7: board, bottom side, seen from below]

Outline 18.5 x 15.98 mm; copper layers: Top Layer, Bottom Layer. Coordinates in mm from the lower left corner of the outline.
Outline path: 15.62,0.02 arc(9.27,15.98) 2.86,0.05 15.85,0
Stack: Top Layer 0.035mm / Dielectric1 1.51mm FR4 er 4.5 / Bottom Layer 0.035mm

## Design rules (mm)
spacing Default (default): track to track 0.152, other pairs 0 to 0.152
track width Default (default): min 0.254, default 0.254, max 25.4
differential pair differentialPair (default): width min 0.127, default 0.254, max 2.54; gap min 0.152, default 0.152
via Default (default): diameter min 0.61, default 0.61, max 100.025; hole min 0.305, default 0.305, max 59.995

## Placement (name value [footprint] x y rotation side)
3.3V  TESTPAD50  [TESTPAD-50-ROUND#2]  9 15.11 180 bottom
C1  1uF  [C0402]  2.65 10.92 270 top
C3  1uF  [C0402]  5.06 13.21 90 top
C4  10uF  [C0402]  0.93 7.62 270 top
C5  100pF  [C0603]  2.4 8.13 90 top
C7  4.7pF  [C0402]  11.95 13.84 270 top
C8  4.7pF  [C0402]  6.27 13.84 90 top
FLASH  TESTPAD50  [TESTPAD-50-ROUND#4]  7.48 14.99 180 bottom
GND  M01SPRING-CONN  [SPRING-CONNECTOR]  9.25 6.73 0 top
GND#2  TESTPAD50  [TESTPAD-50-ROUND#3]  2.27 11.43 180 bottom
NOREF  -  [Pad_e114]  9.25 6.73 0 top
R1  12kΩ  [R0402]  10.52 11.05 90 top
R2  200  [R0402]  17.38 8.13 270 top
R3  10K  [R0402]  7.73 3.68 270 top
R4  10K  [R0402]  8.88 3.68 270 top
R6  10K  [R0402]  3.85 12.19 270 top
R7  10K  [R0402]  3.54 4.19 270 top
R12  30kΩ  [R0402]  1.89 4.57 0 top
R14  12kΩ  [R0402]  1.38 5.74 180 top
RESET  TESTPAD50  [TESTPAD-50-ROUND]  3.41 12.83 180 bottom
RX  TESTPAD50  [TESTPAD-50-ROUND#3]  5.95 14.48 180 bottom
TX  TESTPAD50  [TESTPAD-50-ROUND#3]  4.55 13.72 180 bottom
U1  ESP8266EX  [QFN-32_L5.0-W5.0-P0.50-BL-EP3.7]  6.82 8.13 270 top
U2  W25Q32JVSSIQ  [SOIC-8_L5.3-W5.3-P1.27-LS8.0-BL]  13.68 7.77 180 top
U7  -  [CON16]  6.88 0.78 0 top
X1  26MHz  [CRYSTAL-SMD_4P-L3.2-W2.5-BL]  9.25 13.84 0 top

## Footprints (pads in the part's own frame, mm; a bottom-side part is the same pattern mirrored in y, then rotated)
C0402
  rect 0.79x0.54 smd: 1(-0.545,0) 2(0.545,0)
C0603
  rect 0.8x0.9 smd: 1(-0.7,0) 2(0.7,0)
CON16
  rect 0.3x1.2 smd: 1(-3.746,0) 2(-3.245,0) 3(-2.746,0) 4(-2.245,0) 5(-1.746,0) 6(-1.246,0) 7(-0.746,0) 8(-0.246,0) 9(0.254,0) 10(0.754,0) 11(1.254,0) 12(1.754,0) 13(2.254,0) 14(2.754,0) 15(3.254,0) 16(3.754,0)
CRYSTAL-SMD_4P-L3.2-W2.5-BL
  rect 1.4x1.2 smd: 1(-1.1,-0.85) 2(1.1,-0.85) 3(1.1,0.85) 4(-1.1,0.85)
Pad_e114
  custom 7.112x7.112 smd far side: P$2(0,0)
QFN-32_L5.0-W5.0-P0.50-BL-EP3.7
  oval 0.28x0.9 smd: 1(-1.75,-2.55) 2(-1.25,-2.55) 3(-0.75,-2.55) 4(-0.249,-2.55) 5(0.249,-2.55) 6(0.75,-2.55) 7(1.25,-2.55) 8(1.75,-2.55) 17(1.75,2.55) 18(1.25,2.55) 19(0.75,2.55) 20(0.249,2.55) 21(-0.249,2.55) 22(-0.75,2.55) 23(-1.25,2.55) 24(-1.75,2.55)
  oval 0.9x0.28 smd: 9(2.55,-1.75) 10(2.55,-1.25) 11(2.55,-0.75) 12(2.55,-0.249) 13(2.55,0.249) 14(2.55,0.75) 15(2.55,1.25) 16(2.55,1.75) 25(-2.55,1.75) 26(-2.55,1.25) 27(-2.55,0.75) 28(-2.55,0.249) 29(-2.55,-0.249) 30(-2.55,-0.75) 31(-2.55,-1.25) 32(-2.55,-1.75)
  rect 3.7x3.7 smd: 33(0.001,0)
R0402
  rect 0.566x0.54 smd: 1(-0.433,0) 2(0.433,0)
SOIC-8_L5.3-W5.3-P1.27-LS8.0-BL
  oval 0.63x2.25 smd: 1(-1.905,-3.53) 2(-0.635,-3.53) 3(0.635,-3.53) 4(1.905,-3.53) 5(1.905,3.53) 6(0.635,3.53) 7(-0.635,3.53) 8(-1.905,3.53)
SPRING-CONNECTOR
  custom 7.112x7.112 smd far side: P$2(0,0)
TESTPAD-50-ROUND
  custom 1.27x1.27 smd: 1(0.078,-0.146)
TESTPAD-50-ROUND#2
  custom 1.27x1.27 smd: 1(1.511,-0.137)
TESTPAD-50-ROUND#3
  custom 1.27x1.27 smd: 1(-0.025,0.021)
TESTPAD-50-ROUND#4
  custom 1.27x1.27 smd: 1(-1.524,0.127)

## Nets
As in the schematic, except:
GND: C1.2 C3.2 C4.2 C5.1 C7.2 C8.2 GND.P$2 GND#2.1 NOREF.P$2 R1.1 R12.2 U1.33 U2.4 U7.10 U7.11 U7.12 X1.2 X1.4

Pads without a net: U1 5 10 13; U7 15

## Via types
v1: diameter 0.61, hole 0.305, Top Layer to Bottom Layer, 34 vias

## Routing (per net, layer and track width the routed paths; a pad name or vN(x,y) marks a point on that pad's centre or on a via; arc(x,y) is an arc through that point)
+3.3V: length 71
  Top Layer w0.254: v1(5.8,4.44) 5.99,4.44 6.05,4.39 6.05,4.39 6.05,5.71 ; 4.27,8.51 v1(4.28,8.64) 4.26,8.88 4.19,8.88 ; 4.27,8.51 3.82,8.51 ; 4.27,8.51 4.27,8.39 4.26,8.38 ; 2.24,8.68 2.39,8.83 ; 9.61,6.1 9.36,6.34 9.36,6.38 ; 4.19,8.88 3.82,8.51 ; 4.19,8.88 4.01,8.88 3.64,8.51 ; 3.82,8.51 3.64,8.51 ; 3.82,8.51 3.69,8.38 4.26,8.38 ; 4.26,8.38 4.27,8.51 ; U1.29 6.31,10.68 ; 6.31,10.68 6.31,11.56 6.21,11.43 6.06,11.58 ; 6.31,10.68 6.18,10.68 6.06,10.8 6.06,10.8 ; 3.64,8.51 3.51,8.38 ; 8.24,3.12 8.24,2.69
  Top Layer w0.4: 4.26,9.88 4.05,9.88 3.74,10.18 3.74,11.14 4.97,12.57 5.56,12.57 ; 5.56,12.57 6.06,12.06 ; 5.56,12.57 5.31,12.82 5.31,12.92 ; 6.06,12.06 U1.30 ; 6.06,12.06 6.56,11.56 U1.29 ; 2.24,8.68 1.44,8.68 C4.1 ; 2.24,8.51 2.37,8.38 3.5,8.38 3.51,8.38 3.65,8.38
  Top Layer w0.5: 4.27,8.51 4.27,8.51 v1(4.28,8.64) 4.28,8.77 ; 7.75,3.12 8.67,3.12 ; 7.75,3.12 7.7,3.12 ; 7.75,3.12 7.75,2.95 v1(7.73,2.92) 7.95,2.69 8.24,2.69 8.67,3.12 ; 8.67,3.12 8.85,3.12 ; 2.24,8.51 2.24,8.7
  Top Layer w0.7: v1(10.88,2.92) 10.77,2.92 10.77,4.57 9.61,5.74 9.61,6.1
  Top Layer w0.8: v1(5.8,4.44) 5.8,1.12 ; v1(10.88,2.92) 10.88,2.79 11.89,1.78 14.08,1.78 15.58,3.28 U2.8
  Bottom Layer w0.254: v1(3.54,3.68) 4.3,4.44 v1(5.8,4.44) 6.11,4.44 6.33,4.22
  Bottom Layer w0.8: 10.91,2.97 arc(5.76,4.56) 6.61,9.88 ; 16.68,9 arc(17.02,6.6) 16.6,4.2 ; v1(6.31,10.88) 6.58,10.6 6.58,9.91 ; v1(15.58,4.2) 15.59,4.19 16.36,4.19 16.62,4.44 ; v1(4.28,8.64) 5.31,8.64 5.44,8.51 ; 7.47,14.99 7.85,14.6 7.85,14.58 9.48,12.95 12.81,12.95 16.62,9.14
  vias: v1(5.7,1.27)
GND: length 38.4
  Top Layer w0.254: C8.2 5.7,14.96 ; R1.1 11.49,10.62 ; C1.2 2.31,10.38 1.51,11.18 ; X1.4 7.35,15.49 ; 2.25,7.3 0.97,7.3 0.75,7.07 ; C3.2 4.49,14.33
  Top Layer w0.7: v1(11.54,10.67) 11.77,10.9 U2.4 ; 11.62,11.56 11.67,11.51 11.67,13.25 10.33,13.25
  Bottom Layer w0.254: v1(2.27,4.7) 2.27,7.2 v1(2.37,7.3) 2.52,7.45 v1(2.52,10.41)
  Bottom Layer w0.7: v1(11.54,10.67) 11.54,10.03 9.34,7.83 v1(8.15,7.83)
  Bottom Layer w0.8: 12.15,3.68 9.25,6.58 GND.P$2 v1(8.15,7.83) ; v1(5.19,9.78) 4.94,10.03 2.9,10.03 v1(2.52,10.41) 2.52,11.22 GND#2.1 ; v1(8.11,1.02) 8.99,1.02 9.23,1.25
  Bottom Layer w1: 9.23,1.25 11.12,1.25 12.15,2.29 12.15,3.68 11.25,4.43
  vias: v1(6.82,8.13)
ANT: length 10.4
  Top Layer w0.254: 3.26,9.14 3.5,9.38 4.27,9.38 ; v1(2.52,3.68) 3.64,2.57 U7.2
  Bottom Layer w0.254: v1(2.52,3.68) 2.9,4.06 2.9,6.73 3.03,6.86 3.03,9.14 3.26,9.14
  vias: v1(3.41,9.14)
BATTERY: length 6.4
  Top Layer w0.254: 3.07,0.33 arc(1.36,2.61) 0.46,5.31 0.89,5.74 R14.2
CLK: length 6.9
  Top Layer w0.254: 13.04,4.2 13.04,6.35 15.58,6.35 16.93,7.69 17.23,7.69
CS: length 9.2
  Top Layer w0.254: 15.58,11.4 14.95,11.4 14.95,8.76 14.06,7.88 9.37,7.88
D0: length 6.9
  Top Layer w0.254: 14.31,11.4 14.31,9.91 13.28,8.88 9.37,8.88
D1: length 14
  Top Layer w0.254: 9.37,9.38 12.92,9.38 v1(13.19,9.65) ; v1(13.7,2.79) 12.41,2.79 11.77,3.43 11.77,4.2
  Bottom Layer w0.254: v1(13.7,2.79) 13.73,2.82 13.73,8.58 13.19,9.12 v1(13.19,9.65)
IO0: length 38.2
  Top Layer w0.254: U1.15 8.06,5 8.36,4.7 8.77,4.7 9.48,3.99 9.48,2.79 8.59,1.91 v1(7.83,1.91)
  Bottom Layer w0.254: 8.94,15.7 arc(17.51,10.24) 15.48,0.28 ; 15.45,0.28 6.96,0.28 6.96,1.91 v1(7.83,1.91)
IO2: length 5.7
  Top Layer w0.254: U7.9 7.14,1.99 6.97,2.16 6.97,3.99 7.71,3.99 7.57,4.13 U1.14
IO9: length 11.7
  Top Layer w0.254: 9.37,6.88 15.22,6.88 v1(16.09,7.75)
  Bottom Layer w0.254: v1(13.06,10.54) 14.08,10.54 15.6,9.02 15.65,9.02 16.11,8.55 16.11,8.51 16.12,8.5 16.12,7.78
IO10: length 10.1
  Top Layer w0.254: 9.37,7.38 14.83,7.38 v1(15.07,7.62)
  Bottom Layer w0.254: v1(15.07,7.62) 15.33,7.62 15.33,4.95 14.58,4.2 v1(14.31,4.2)
IO16: length 5.7
  Top Layer w0.254: U7.3 4.14,1.81 4.17,1.85 4.17,6.28 U1.8
LEDB: length 29.7
  Top Layer w0.254: 15.81,12.85 arc(18.19,7.47) 16.73,1.78 15.09,1.78 14.2,0.89 11.77,0.89 10.75,1.91 10.11,1.91 9.63,1.42 9.63,0.95 ; U1.24 12.4,9.88 12.42,9.91 12.42,12.57 12.68,12.83 15.73,12.83
LEDG: length 5.6
  Top Layer w0.254: 9.13,0.95 9.13,1.65 10.02,2.54 10.02,4.19 8.63,5.58 8.57,5.58
LEDR: length 5
  Top Layer w0.254: U7.4 4.64,4.15 5.06,4.57 5.06,5.57 U1.9
RESET: length 5.3
  Top Layer w0.254: C1.1 2.65,11.68 3.59,12.62 v1(3.67,12.62) ; 5.07,10.68 4.82,10.92 v1(4.43,10.92)
  Bottom Layer w0.254: v1(4.43,10.92) 3.99,11.36 3.99,12.03 3.67,12.35 ; 3.67,12.35 3.39,12.62 ; 3.67,12.35 v1(3.67,12.62) 3.39,12.62 ; 3.39,12.62 3.39,12.68 3.28,12.78
RVRY: length 4.8
  Top Layer w0.254: U7.8 6.64,1.6 6.56,1.68 6.56,5.57 U1.12
RX: length 26.3
  Top Layer w0.254: 8.57,10.68 8.57,10.74 v1(9.51,11.68) ; v1(15.35,1.14) 14.49,0.28 11.14,0.28 U7.16
  Bottom Layer w0.254: v1(15.35,1.14) 14.33,1.14 13.06,2.41 13.06,3.17 13.32,3.43 13.32,8.38 12.3,9.4 12.3,10.8 11.41,11.68 v1(9.51,11.68) 8.75,11.68 RX.1
TX: length 5.4
  Top Layer w0.254: U1.26 8.11,10.72 v1(8.11,11.43)
  Bottom Layer w0.254: v1(8.11,11.43) 6.84,12.7 5.95,12.7 4.55,14.1
$1N18697: length 7.5
  Top Layer w0.254: 5.57,10.68 5.57,11.28 v1(5.17,11.68) ; v1(9.64,10.79) 9.64,10.92 10.2,11.48 R1.2
  Bottom Layer w0.254: v1(9.64,10.79) 7.48,10.79 6.71,11.56 5.04,11.56 v1(5.17,11.68)
$1N18698: length 2.7
  Top Layer w0.254: 3.52,4.72 3.52,6.6 3.79,6.88 4.27,6.88
$1N18707: length 4.6
  Top Layer w0.254: 7.07,10.68 7.07,12.41 6.46,13.02 6.46,13.3 8.08,13.3 8.13,13.25
$1N18708: length 8.5
  Top Layer w0.254: U1.27 7.57,11.21 7.47,11.31 7.47,12.06 7.48,12.06 9,12.06 9.25,12.32 9.25,14.6 10.27,14.6 X1.3 11.65,14.69 C7.1
$1N18714: length 8.5
  Top Layer w0.254: 9.37,8.38 13.67,8.38 v1(14.31,9.02) ; v1(15.45,8.38) 15.63,8.56 17.23,8.56
  Bottom Layer w0.254: v1(15.45,8.38) 14.82,9.02 v1(14.31,9.02)
$1N18731: length 4.7
  Top Layer w0.254: R12.1 1.63,4.75 1.63,5.97 2.25,5.97 3.66,7.38 4.27,7.38

## Copper pours and planes (outline as drawn; the poured copper is in the pictures)
+3.3V on Top Layer: 5.04,1.4 6.18,1.4 6.18,0.25 5.04,0.25
+3.3V on Bottom Layer: -0.65,16.51 19.29,16.51 19.29,-0.51 -0.65,-0.51
GND on Top Layer: -0.65,16.64 19.29,16.64 19.29,-0.38 -0.65,-0.38
GND on Top Layer: 7.58,1.4 8.72,1.4 8.72,0.25 7.58,0.25

## Text on the board
Bottom Silkscreen Layer: GND

# Board PCB-Selector
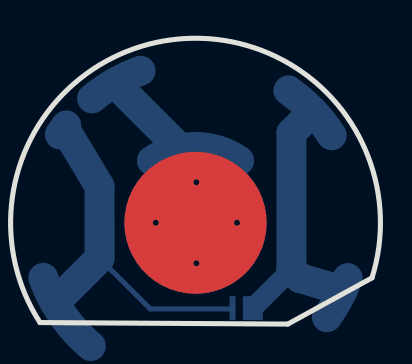
[diagram p8: board, top side]
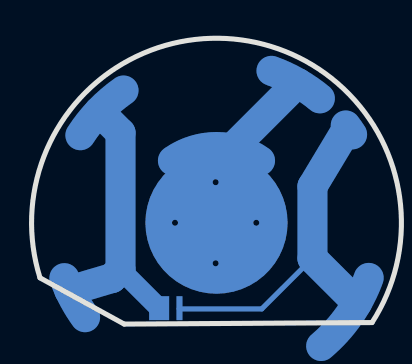
[diagram p9: board, bottom side, seen from below]

Outline 18.5 x 14.33 mm; copper layers: Top Layer, Bottom Layer. Coordinates in mm from the lower left corner of the outline.
Outline path: 1.47,0.08 13.87,0 18.08,2.32 arc(8.01,14.25) 1.47,0.08
Stack: Top Layer 0.035mm / Dielectric1 1.51mm FR4 er 4.5 / Bottom Layer 0.035mm

## Design rules (mm)
spacing Default (default): track to track 0.152, other pairs 0 to 0.152
track width Default (default): min 0.254, default 0.254, max 25.4
differential pair differentialPair (default): width min 0.127, default 0.254, max 2.54; gap min 0.152, default 0.152
via Default (default): diameter min 0.61, default 0.61, max 100.025; hole min 0.305, default 0.305, max 59.995

## Placement (name value [footprint] x y rotation side)
JP1  M01SPRING-CONN  [SPRING-CONNECTOR]  12.81 -11.18 0 top
JP2  -  [CON3]  11.61 0.78 180 bottom
NOREF  -  [Pad_e39]  9.25 5.08 0 top

## Footprints (pads in the part's own frame, mm; a bottom-side part is the same pattern mirrored in y, then rotated)
CON3
  rect 1x1.2 smd: 1(-0.508,0.018)
  rect 0.3x1.2 smd: 2(0.508,0.018)
Pad_e39
  custom 7.112x7.112 smd far side: P$2(0,0)
SPRING-CONNECTOR
  custom 7.112x7.112 smd: P$2(-3.556,16.256)

## Nets
BATTERY: JP1.P$2 NOREF.P$2
DMXA: JP2.1
DMXB: JP2.2

## Via types
v1: diameter 0.61, hole 0.305, Top Layer to Bottom Layer, 4 vias

## Routing (per net, layer and track width the routed paths; a pad name or vN(x,y) marks a point on that pad's centre or on a via; arc(x,y) is an arc through that point)
BATTERY: length 12.1
  Bottom Layer w1.5: 4.08,11.31 arc(5.23,12.11) 6.5,12.7 ; 7.07,8.19 arc(9.25,8.88) 11.43,8.19 ; 5.16,12.07 5.21,12.07 8.48,8.8
  vias: v1(7.26,5.08) v1(9.29,7.11) v1(9.29,3.05) v1(11.33,5.08)
DMXA: length 19.3
  Bottom Layer w1: 12.13,0.76 12.13,0.82 14.05,2.74
  Bottom Layer w1.5: 13.9,11.71 arc(15.09,10.69) 16.06,9.47 ; 16.86,2.31 arc(16.41,1.29) 15.82,0.34 ; 15.12,10.66 14.05,9.59 14.05,2.74 14.48,2.31 16.61,1.68
DMXB: length 22.5
  Bottom Layer w0.254: 4.45,3.3 6.98,0.76 11.12,0.76
  Bottom Layer w1.5: 2.47,9.5 arc(2.62,9.74) 2.79,9.96 ; 4.01,-1.1 arc(2.6,0.45) 1.64,2.32 ; 2.79,9.68 4.45,6.91 4.45,3.3 2.22,1.06

# Board PCB_Power
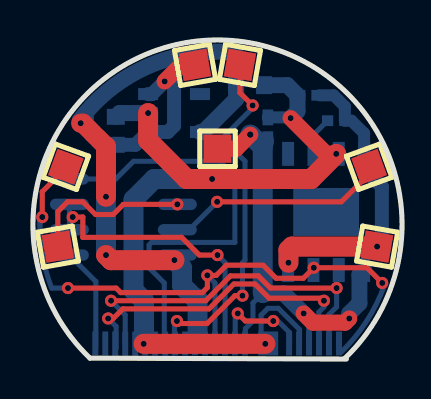
[diagram p10: board, top side]
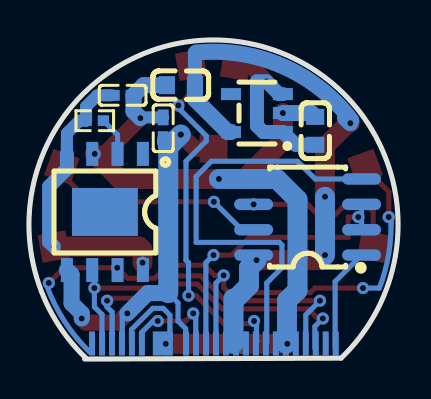
[diagram p11: board, bottom side, seen from below]

Outline 18.5 x 15.98 mm; copper layers: Top Layer, Bottom Layer. Coordinates in mm from the lower left corner of the outline.
Outline path: 15.62,0.02 arc(9.27,15.98) 2.86,0.05 15.71,0
Stack: Top Layer 0.035mm / Dielectric1 1.51mm FR4 er 4.5 / Bottom Layer 0.035mm

## Design rules (mm)
spacing Default (default): track to track 0.152, other pairs 0 to 0.152
track width Default (default): min 0.254, default 0.254, max 25.4
differential pair differentialPair (default): width min 0.127, default 0.254, max 2.54; gap min 0.152, default 0.152
via Default (default): diameter min 0.61, default 0.61, max 100.025; hole min 0.305, default 0.305, max 59.995

## Placement (name value [footprint] x y rotation side)
C2  100pF  [C0603]  4.16 11.43 270 bottom
C9  100pF  [C0603]  10.89 13.72 180 bottom
C10  10uF  [C0402]  13.81 13.21 180 bottom
C11  10uF  [C0402]  11.78 11.56 90 bottom
CN1  SCTA3A0103  [SCTA1A0100]  1.25 5.63 10 top
CN2  SCTA3A0103  [SCTA1A0100]  16.85 9.63 20 top
CN3  SCTA3A0103  [SCTA1A0100]  17.25 5.63 350 top
CN4  SCTA3A0103  [SCTA1A0100]  1.65 9.63 340 top
CN7  SCTA3A0103  [SCTA1A0100]  10.38 14.73 350 top
CN8  SCTA3A0103  [SCTA1A0100]  9.25 10.53 0 top
CN9  SCTA3A0103  [SCTA1A0100]  8.13 14.73 10 top
R8  1.2K  [R0402]  15.2 11.94 180 bottom
U3  ME6211C33M5G-N  [SOT-23-5_L3.0-W1.7-P0.95-LS2.8-BR]  7.08 12.32 180 bottom
U4  SP3485EN-L/TR  [SOIC-8_L5.0-W4.0-P1.27-LS6.0-BL]  4.54 7.11 90 bottom
U5  TP4056_C725790  [ESOP-8_L4.9-W3.9-P1.27-LS6.0-BL-EP]  14.7 7.37 0 bottom
U8  -  [CON6]  14.1 0.78 180 bottom
U9  -  [CON16]  6.88 0.78 180 bottom
U10  -  [CON1]  11.79 0.76 180 bottom

## Footprints (pads in the part's own frame, mm; a bottom-side part is the same pattern mirrored in y, then rotated)
C0402
  rect 0.79x0.54 smd: 1(-0.545,0) 2(0.545,0)
C0603
  rect 0.8x0.9 smd: 1(-0.7,0) 2(0.7,0)
CON1
  rect 1x1.2 smd: 1(0,0.019)
CON6
  rect 0.3x1.2 smd: 1(-1.246,0) 2(-0.746,0) 3(-0.246,0) 4(0.254,0) 5(0.754,0) 6(1.254,0)
CON16
  rect 0.3x1.2 smd: 1(-3.746,0) 2(-3.245,0) 3(-2.746,0) 4(-2.245,0) 5(-1.746,0) 6(-1.246,0) 7(-0.746,0) 8(-0.246,0) 9(0.254,0) 10(0.754,0) 11(1.254,0) 12(1.754,0) 13(2.254,0) 14(2.754,0) 15(3.254,0) 16(3.754,0)
ESOP-8_L4.9-W3.9-P1.27-LS6.0-BL-EP
  rect 0.6x1.2 smd: 1(-1.905,-2.909) 2(-0.635,-2.909) 3(0.635,-2.909) 4(1.905,-2.909) 5(1.905,2.909) 6(0.635,2.909) 7(-0.635,2.909) 8(-1.905,2.909)
  rect 3.3x2.4 smd: 9(0,0)
R0402
  rect 0.566x0.54 smd: 1(-0.433,0) 2(0.433,0)
SCTA1A0100
  rect 1.4x1.4 smd: 1(0,0)
SOIC-8_L5.0-W4.0-P1.27-LS6.0-BL
  oval 0.569x1.95 smd: 1(-1.905,-2.705) 2(-0.635,-2.705) 3(0.635,-2.705) 4(1.905,-2.705) 5(1.905,2.705) 6(0.635,2.705) 7(-0.635,2.705) 8(-1.905,2.705)
SOT-23-5_L3.0-W1.7-P0.95-LS2.8-BR
  rect 1x0.6 smd: 1(1.3,-0.95) 2(1.3,0) 3(1.3,0.95) 4(-1.3,0.95) 5(-1.3,-0.95)

## Nets
+3.3V: C9.2 U3.5 U4.8 U9.5 U9.6 U9.7
GND: C2.1 C9.1 C10.2 C11.2 U3.2 U4.5 U5.3 U8.5 U9.10 U9.11 U9.12 U10.1
ANT: U8.6 U9.2
BATTERY: C11.1 CN8.1 U5.5 U8.4 U9.1
CHARGE: C10.1 CN3.1 R8.1 U5.4 U5.8
DMXA: CN2.1 U4.7
DMXB: CN1.1 U4.6
IO2: U4.4 U9.9
IO16: U4.2 U4.3 U9.3
LEDB: U8.3 U9.14
LEDG: U5.6 U8.2 U9.13
LEDR: CN4.1 U5.7 U8.1 U9.4
POWER: C2.2 CN9.1 U3.1 U3.3
RVRY: CN7.1 U9.8
RX: U4.1 U9.16
$1N2499: R8.2 U5.2

Pads without a net: U3 4; U5 1 9; U9 15

## Via types
v1: diameter 0.61, hole 0.305, Top Layer to Bottom Layer, 35 vias

## Routing (per net, layer and track width the routed paths; a pad name or vN(x,y) marks a point on that pad's centre or on a via; arc(x,y) is an arc through that point)
+3.3V: length 29.7
  Top Layer w0.95: 3.67,10.65 2.51,11.81 v1(2.4,11.81)
  Top Layer w1: v1(3.67,8.13) 3.67,10.65 ; v1(7.1,4.95) 3.93,4.95 v1(3.67,5.21)
  Bottom Layer w0.7: 10.19,13.72 10.19,15.33 10.13,15.39
  Bottom Layer w0.8: 2.36,11.96 arc(5.8,14.67) 10.13,15.35 ; 2.66,12.32 2.66,12.06 v1(2.4,11.81) ; 10.19,13.72 10.19,13.02 8.55,11.37 U3.5
  Bottom Layer w1: 8.26,3.03 8.26,0.78 ; 8.14,3.03 7.48,3.68 7.48,4.57 v1(7.1,4.95) ; v1(3.67,8.13) v1(3.67,5.21)
GND: length 43.8
  Top Layer w0.8: v1(15.2,10.27) 14.71,10.27 v1(12.92,12.06)
  Top Layer w1: v1(5.55,0.76) v1(11.65,0.76) ; v1(15.2,10.27) 13.95,9.02 v1(8.98,9.02) 7.71,9.02 5.78,10.95 v1(5.78,12.32)
  Bottom Layer w0.254: v1(11.65,0.76) 11.44,0.97 11.44,2.2 11.78,2.54 12.3,2.54 13.36,1.48 13.36,0.76
  Bottom Layer w0.6: C11.2 12.88,12.1 v1(12.92,12.06)
  Bottom Layer w0.8: v1(12.92,12.06) 13.26,12.41 C10.2 12.76,13.72 C9.1 ; C2.1 4.35,12.32 v1(5.78,12.32)
  Bottom Layer w1: U9.11 5.57,0.84 5.57,2.92 5.05,3.45 5.05,7.98 6.08,9.02 U4.5 v1(8.98,9.02)
ANT: length 4.9
  Top Layer w0.254: v1(10.27,2.29) 10.65,1.91 v1(12.05,1.91)
  Bottom Layer w0.254: 12.86,0.76 12.86,1.32 12.28,1.91 v1(12.05,1.91) ; 10.13,0.95 10.14,0.97 10.14,2.16 v1(10.27,2.29)
BATTERY: length 22.5
  Top Layer w0.8: v1(13.57,2.29) 14.04,1.82 15.65,1.82 v1(15.86,2.03) ; v1(10.9,11.24) 10.19,10.53 CN8.1
  Bottom Layer w0.254: 10.65,0.98 10.65,1.52 11.03,1.91 11.03,2.81 11.52,3.3 ; 13.83,2.16 13.83,0.8
  Bottom Layer w0.6: C11.1 11.78,10.87 11.52,10.61
  Bottom Layer w0.8: v1(15.86,2.03) 15.86,2.29 16.37,2.79 16.37,4.22 U5.5 ; v1(13.57,2.29) 12.56,3.3 11.52,3.3
  Bottom Layer w1: 10.89,11.24 11.52,10.61 11.52,3.3
CHARGE: length 14.7
  Top Layer w1: v1(12.81,4.83) 12.81,5.46 12.98,5.63 v1(17.25,5.63)
  Bottom Layer w0.6: U5.4 16.6,11.3 15.97,11.94 R8.1 15.64,12.65 15.08,13.21 C10.1
  Bottom Layer w0.7: v1(17.25,5.63) 17.49,5.87 17.49,8.64 16.6,9.52 U5.4
DMXA: length 11.1
  Top Layer w0.254: CN2.1 16.85,9.27 15.46,7.87 v1(9.24,7.87)
  Bottom Layer w0.254: U4.7 7.84,6.48 v1(9.24,7.87)
DMXB: length 8.4
  Top Layer w0.254: v1(7.24,7.75) 4.54,7.75 4.03,7.24 3.14,7.24 2.51,7.87 1.74,7.87 1.25,7.38 CN1.1
IO2: length 21.9
  Bottom Layer w0.254: 6.59,0.76 6.59,3.81 5.83,4.57 5.83,5.71 5.95,5.84 10.13,5.84 10.13,9.14 9.36,9.91 5.05,9.91 4.16,9.02 U4.4
IO16: length 14.9
  Top Layer w0.254: v1(9.25,5.21) 8.35,5.21 7.46,6.1 2.51,6.1 2.51,7.11 v1(2,7.11)
  Bottom Layer w0.254: 9.64,0.56 9.64,4.83 v1(9.25,5.21) ; 1.83,7.07 U4.2 ; 1.83,7.07 U4.3 ; 1.83,7.07 1.95,7.07 v1(2,7.11)
LEDB: length 15.8
  Top Layer w0.254: v1(3.77,2.03) 4.03,2.03 4.51,2.51 8.83,2.51 10.07,3.76 11.13,3.76 11.84,3.05 14.46,3.05 v1(14.59,2.92)
  Bottom Layer w0.254: 14.33,0.79 14.33,2.35 14.59,2.61 v1(14.59,2.92) ; 4.17,0.52 4.17,1.63 v1(3.77,2.03)
LEDG: length 18.4
  Top Layer w0.254: v1(15.22,3.56) 11.91,3.56 11.3,4.17 9.91,4.17 8.66,2.92 v1(3.92,2.92)
  Bottom Layer w0.254: U5.6 15.22,4.35 v1(15.22,3.56) 15.22,2.61 14.84,2.23 U8.2 ; U9.13 4.63,2.21 v1(3.92,2.92)
LEDR: length 33.1
  Top Layer w0.254: v1(1.76,3.56) 4.18,3.56 4.41,3.33 8.5,3.33 8.75,3.58 v1(8.75,4.19) 9.2,4.19 9.7,4.7 11.55,4.7 12.2,4.05 13.56,4.05 v1(14.08,4.57) 16.75,4.57 v1(17.51,3.81) ; v1(0.47,7.11) 0.48,8.38 1.66,9.56 CN4.1
  Bottom Layer w0.254: 0.95,3.54 arc(0.48,5.3) 0.37,7.12 ; 17.62,3.69 arc(16.72,1.88) 15.44,0.33 ; v1(1.76,3.56) 1,3.56 ; 0.36,6.7 0.36,6.99 v1(0.47,7.11) ; v1(8.75,4.19) 9.14,3.81 U9.4
POWER: length 9
  Top Layer w0.8: v1(6.61,13.9) 7.43,14.73 CN9.1
  Bottom Layer w0.7: C2.2 5.14,10.73 U3.1 6.76,11.37 7.08,11.68 7.08,13.9 v1(6.61,13.9) 5.97,13.27 U3.3
RVRY: length 17.8
  Top Layer w0.254: v1(11.01,12.7) 10.38,13.33 CN7.1 ; v1(7.22,1.91) 7.35,1.78 8.73,1.78 10.13,3.17 v1(10.51,3.17)
  Bottom Layer w0.254: 7.08,0.9 7.1,0.92 7.1,1.78 v1(7.22,1.91) ; v1(10.51,3.17) 10.51,4.83 10.63,4.95 10.63,9.91 9.62,10.92 9.62,11.18 10.89,12.45 10.89,12.57 v1(11.01,12.7)
RX: length 5.2
  Bottom Layer w0.254: U4.1 3.16,3.88 3.16,0.54
$1N2499: length 2
  Bottom Layer w0.254: R8.2 14.06,11.23 U5.2

## Copper pours and planes (outline as drawn; the poured copper is in the pictures)
+3.3V on Bottom Layer: 7.48,1.4 8.75,1.4 8.75,0.25 7.48,0.25
GND on Top Layer: -1.8,16.51 21.19,16.51 21.19,-5.08 -1.8,-5.08
CHARGE on Bottom Layer: -0.78,17.02 19.92,17.02 19.92,-1.4 -0.78,-1.4
